# Altium schematic sheet dieukhien.SchDoc
size A0
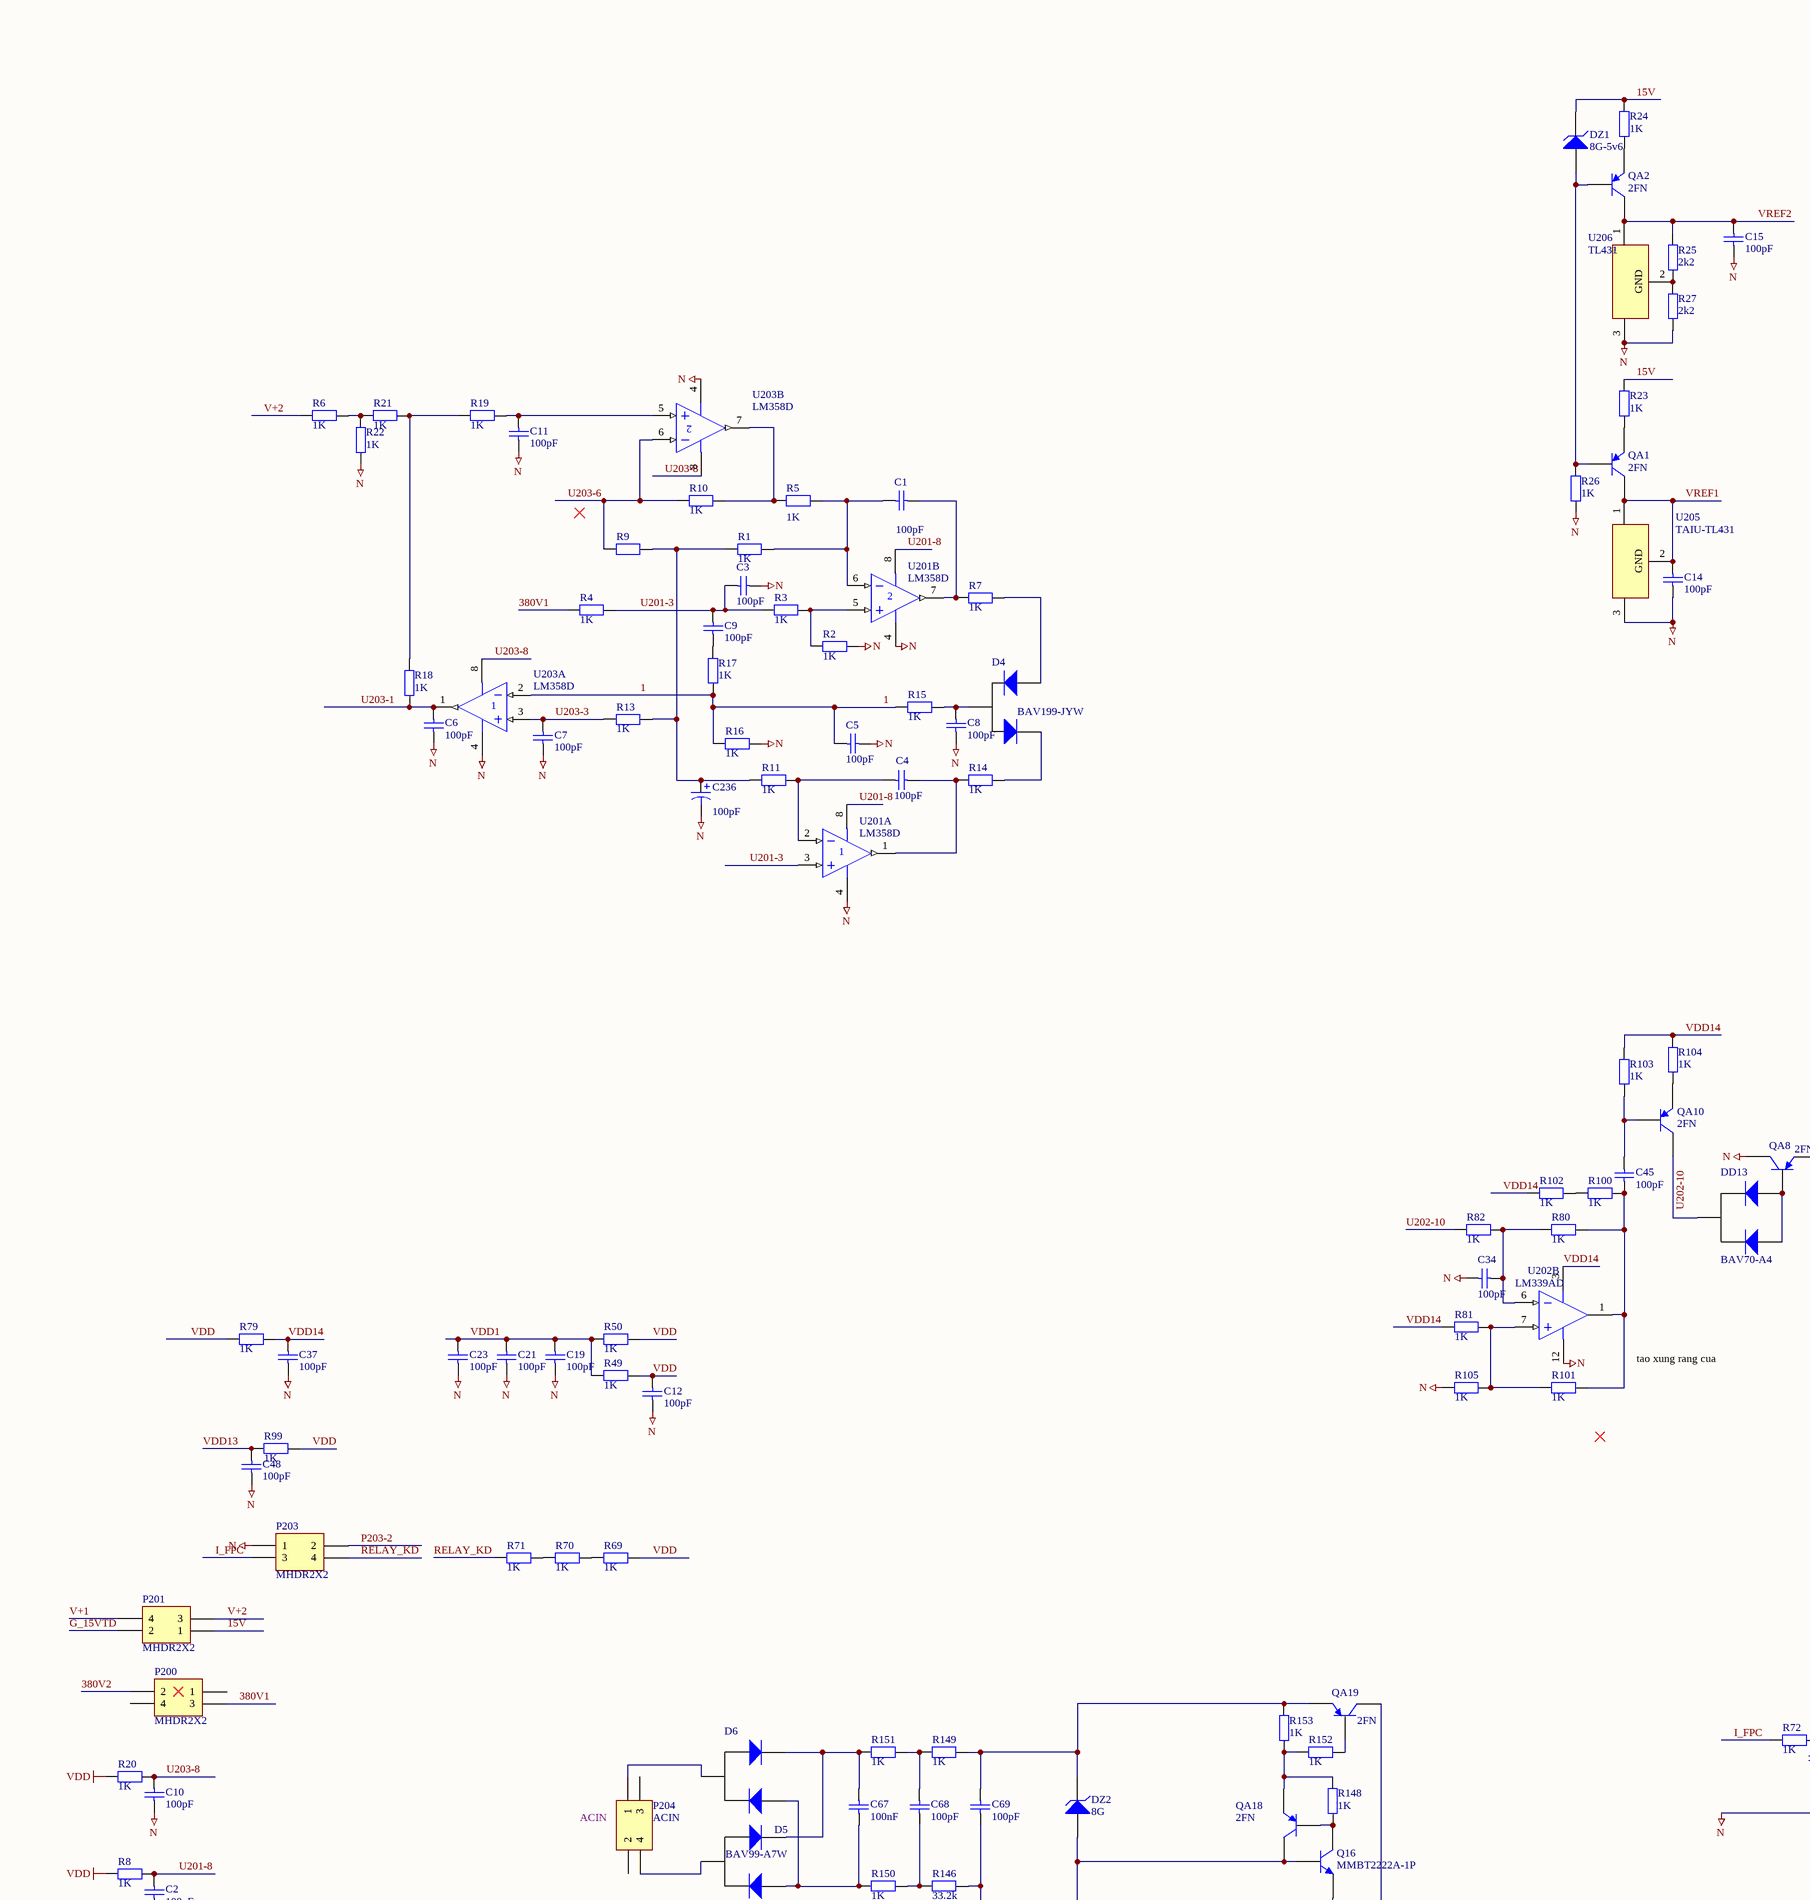
[diagram p0: dieukhien.SchDoc, top left]
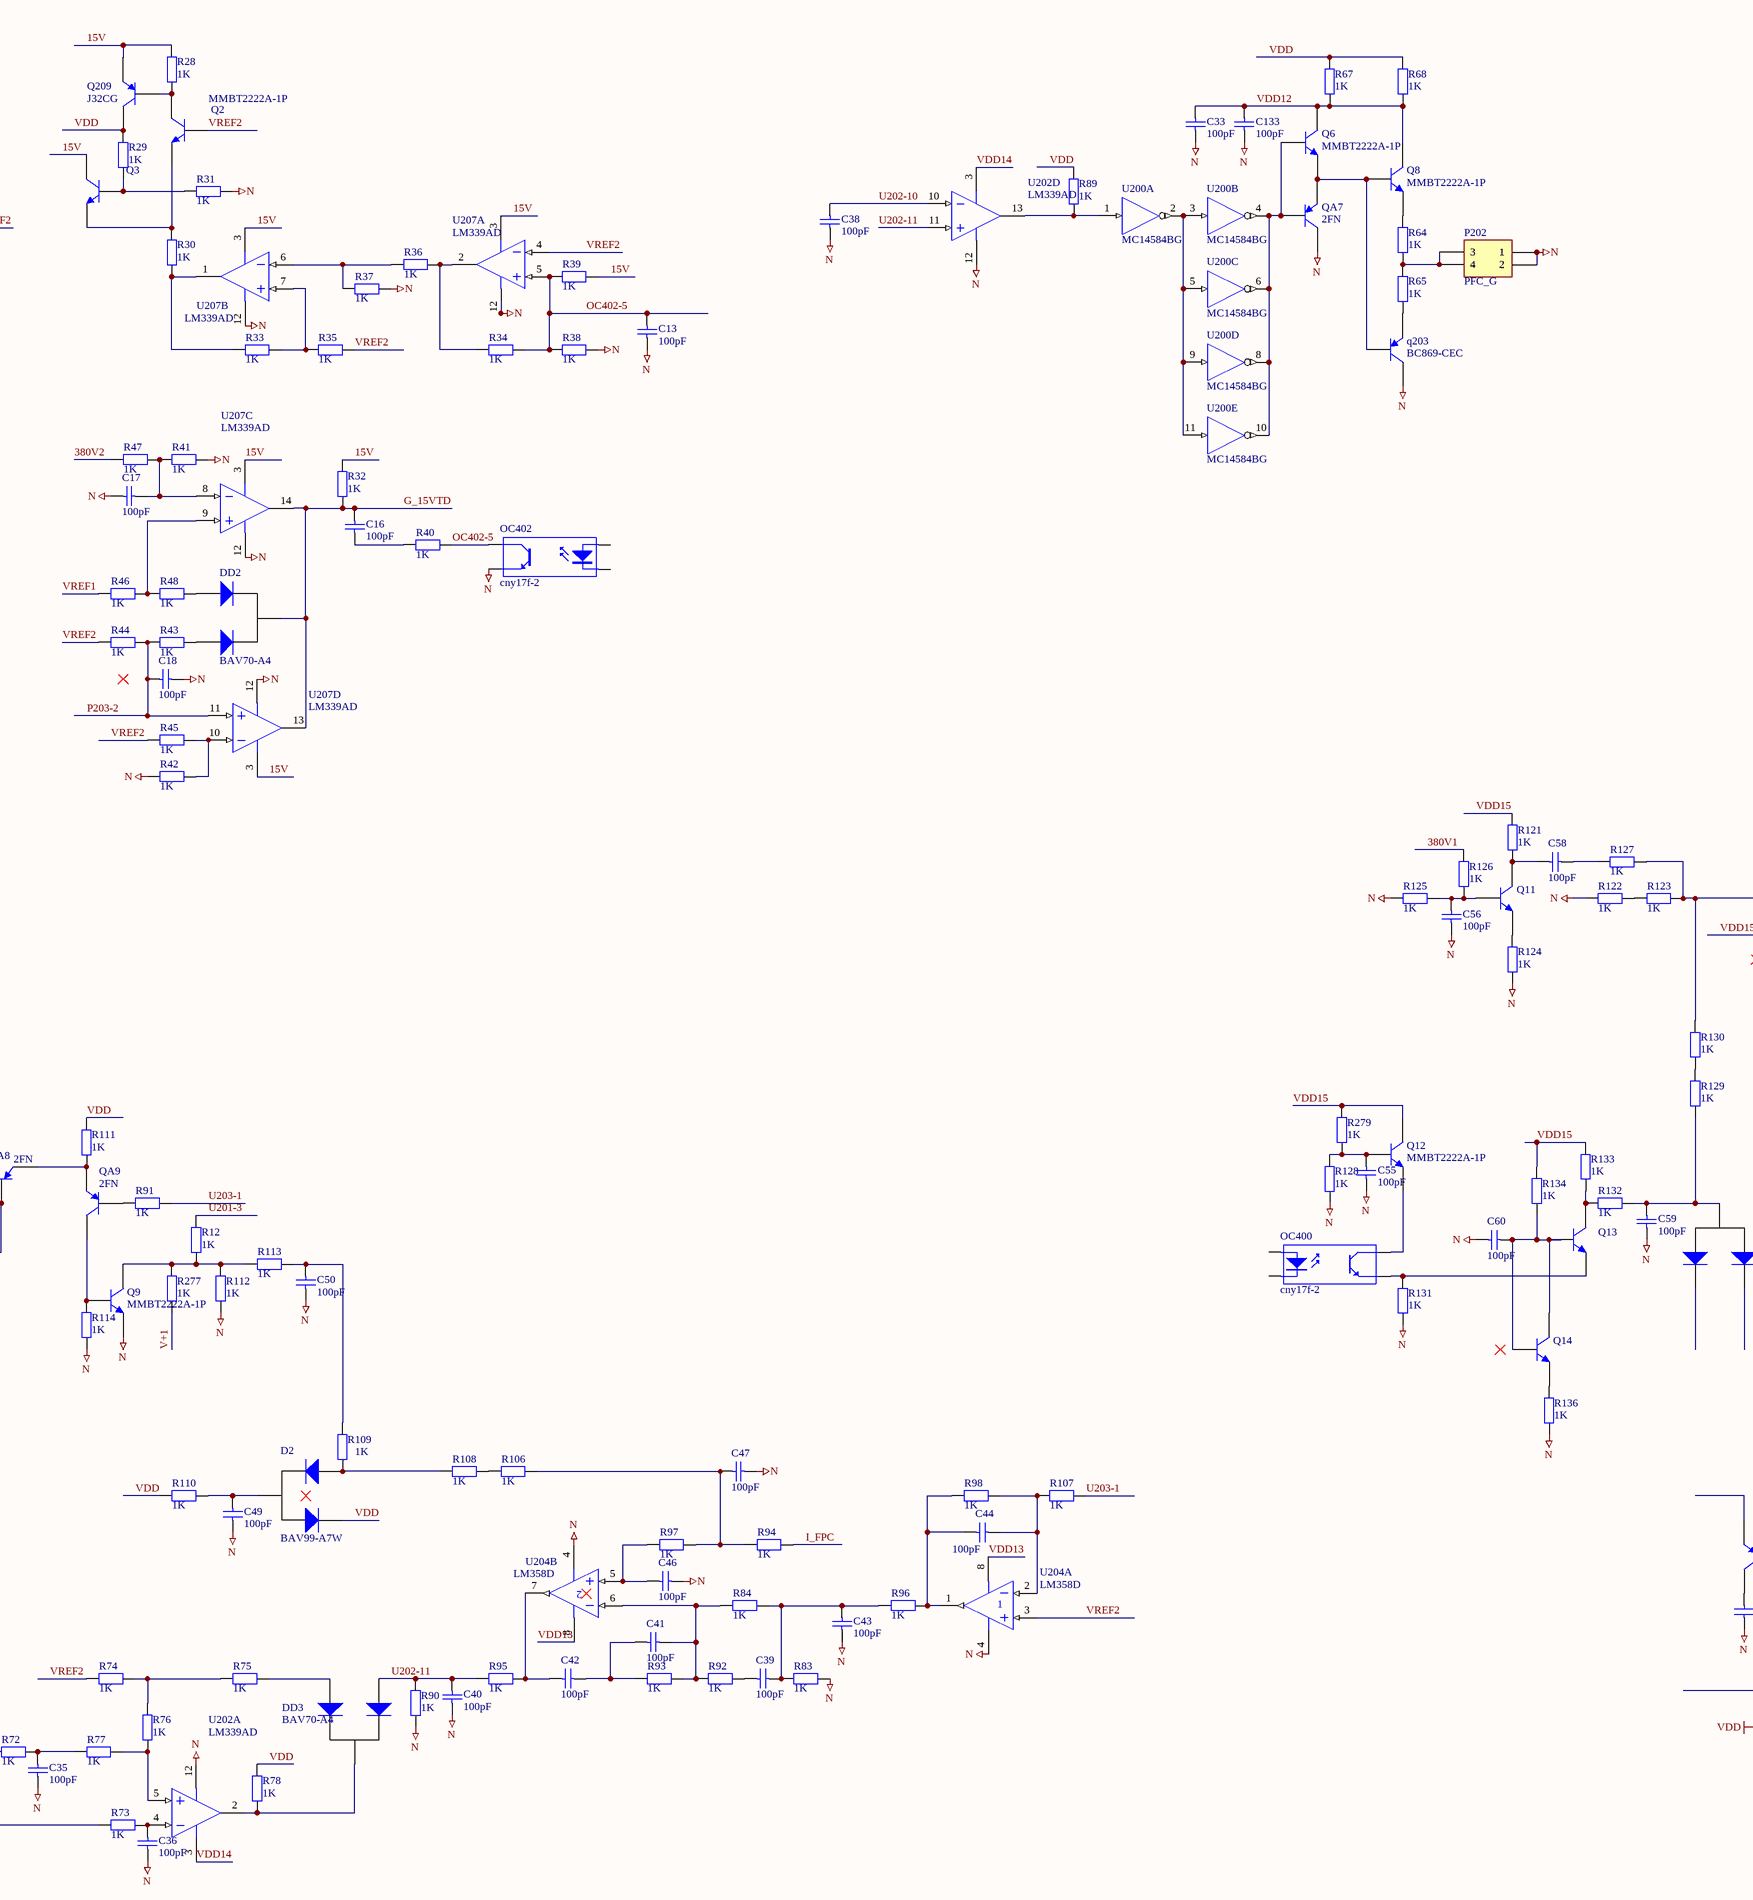
[diagram p1: dieukhien.SchDoc, top middle]
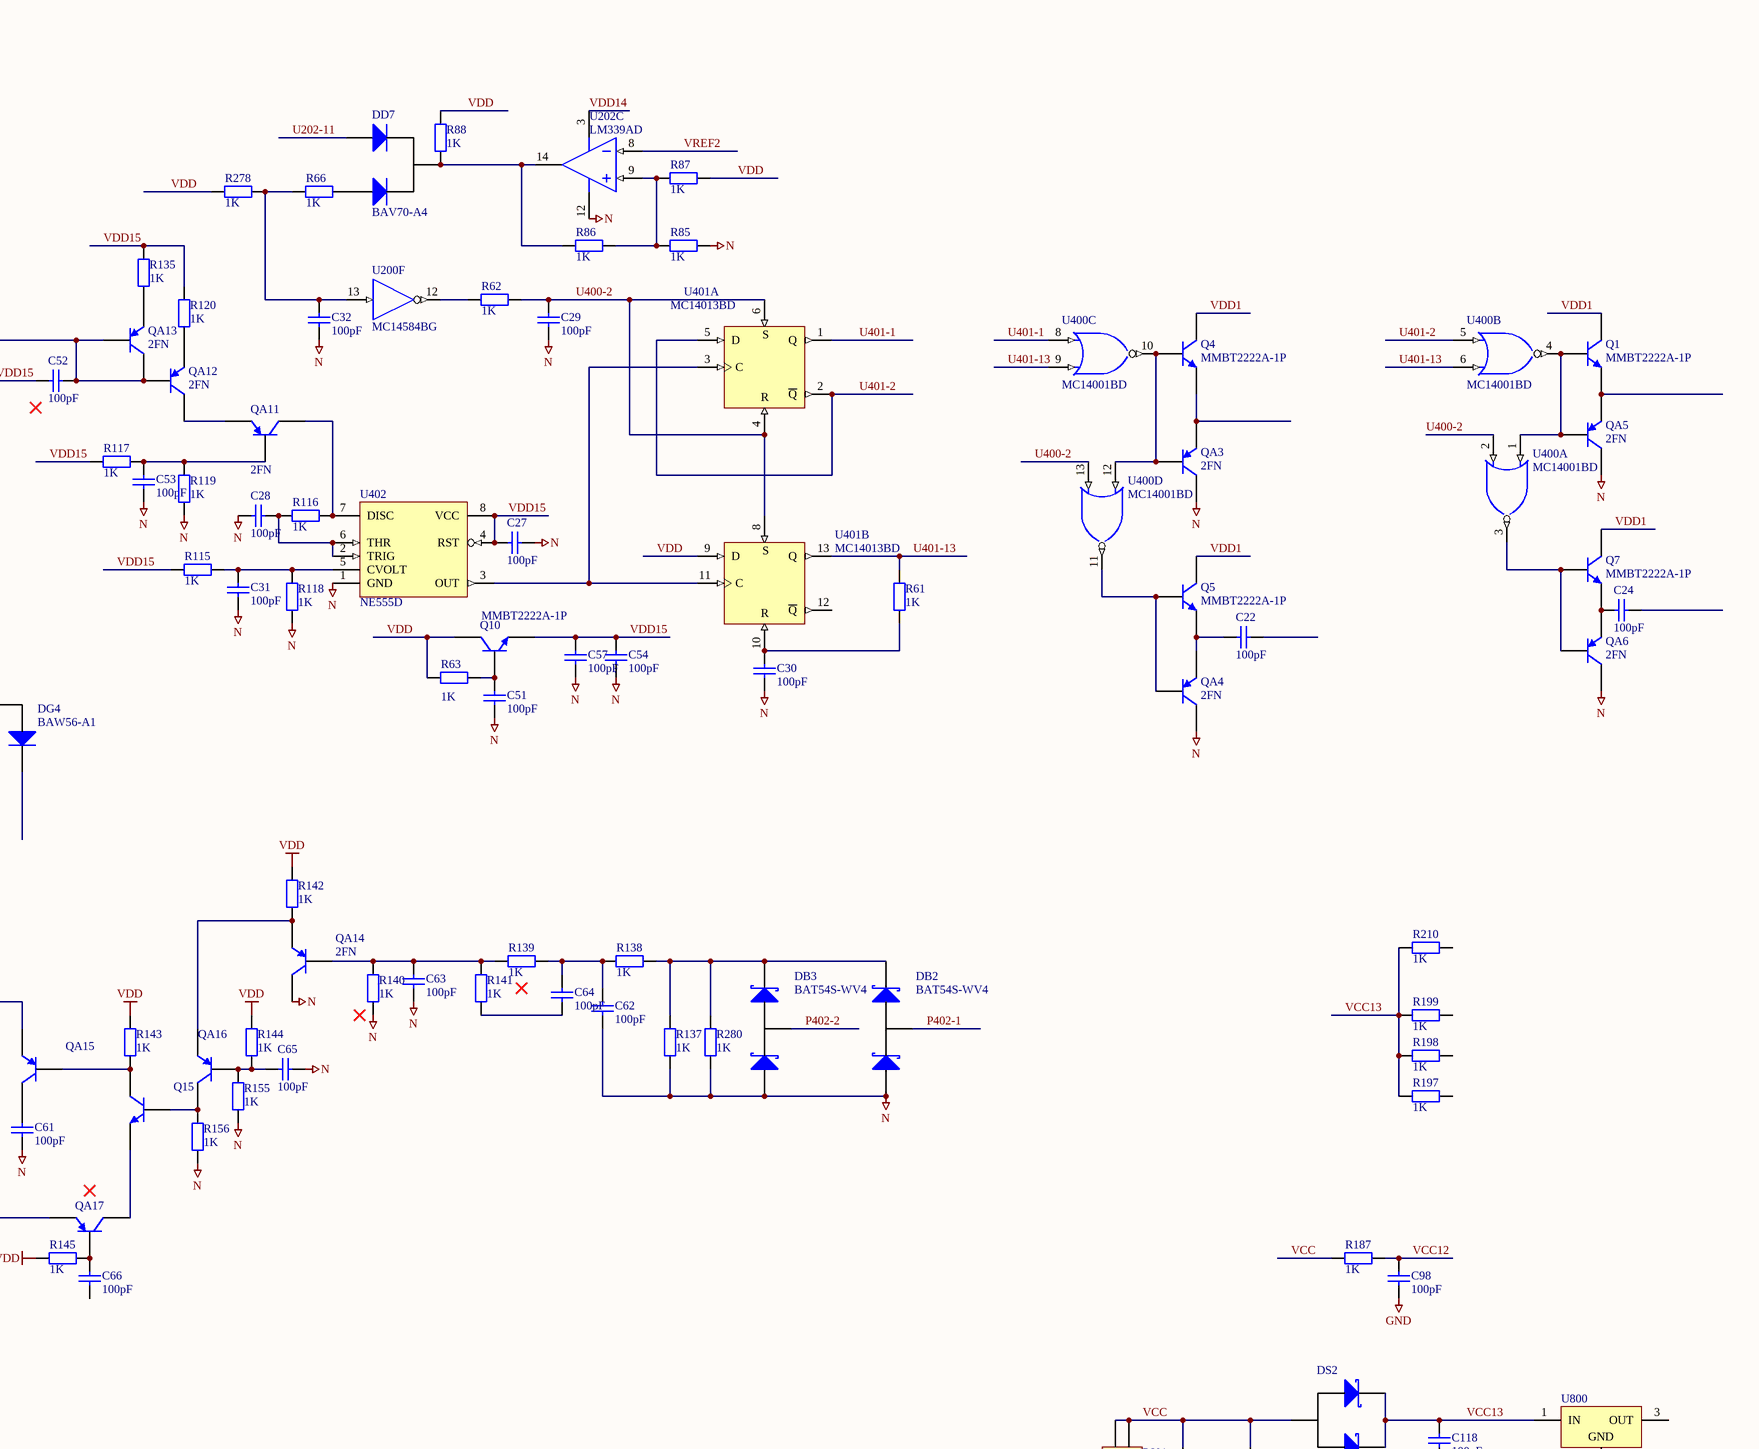
[diagram p2: dieukhien.SchDoc, top right]
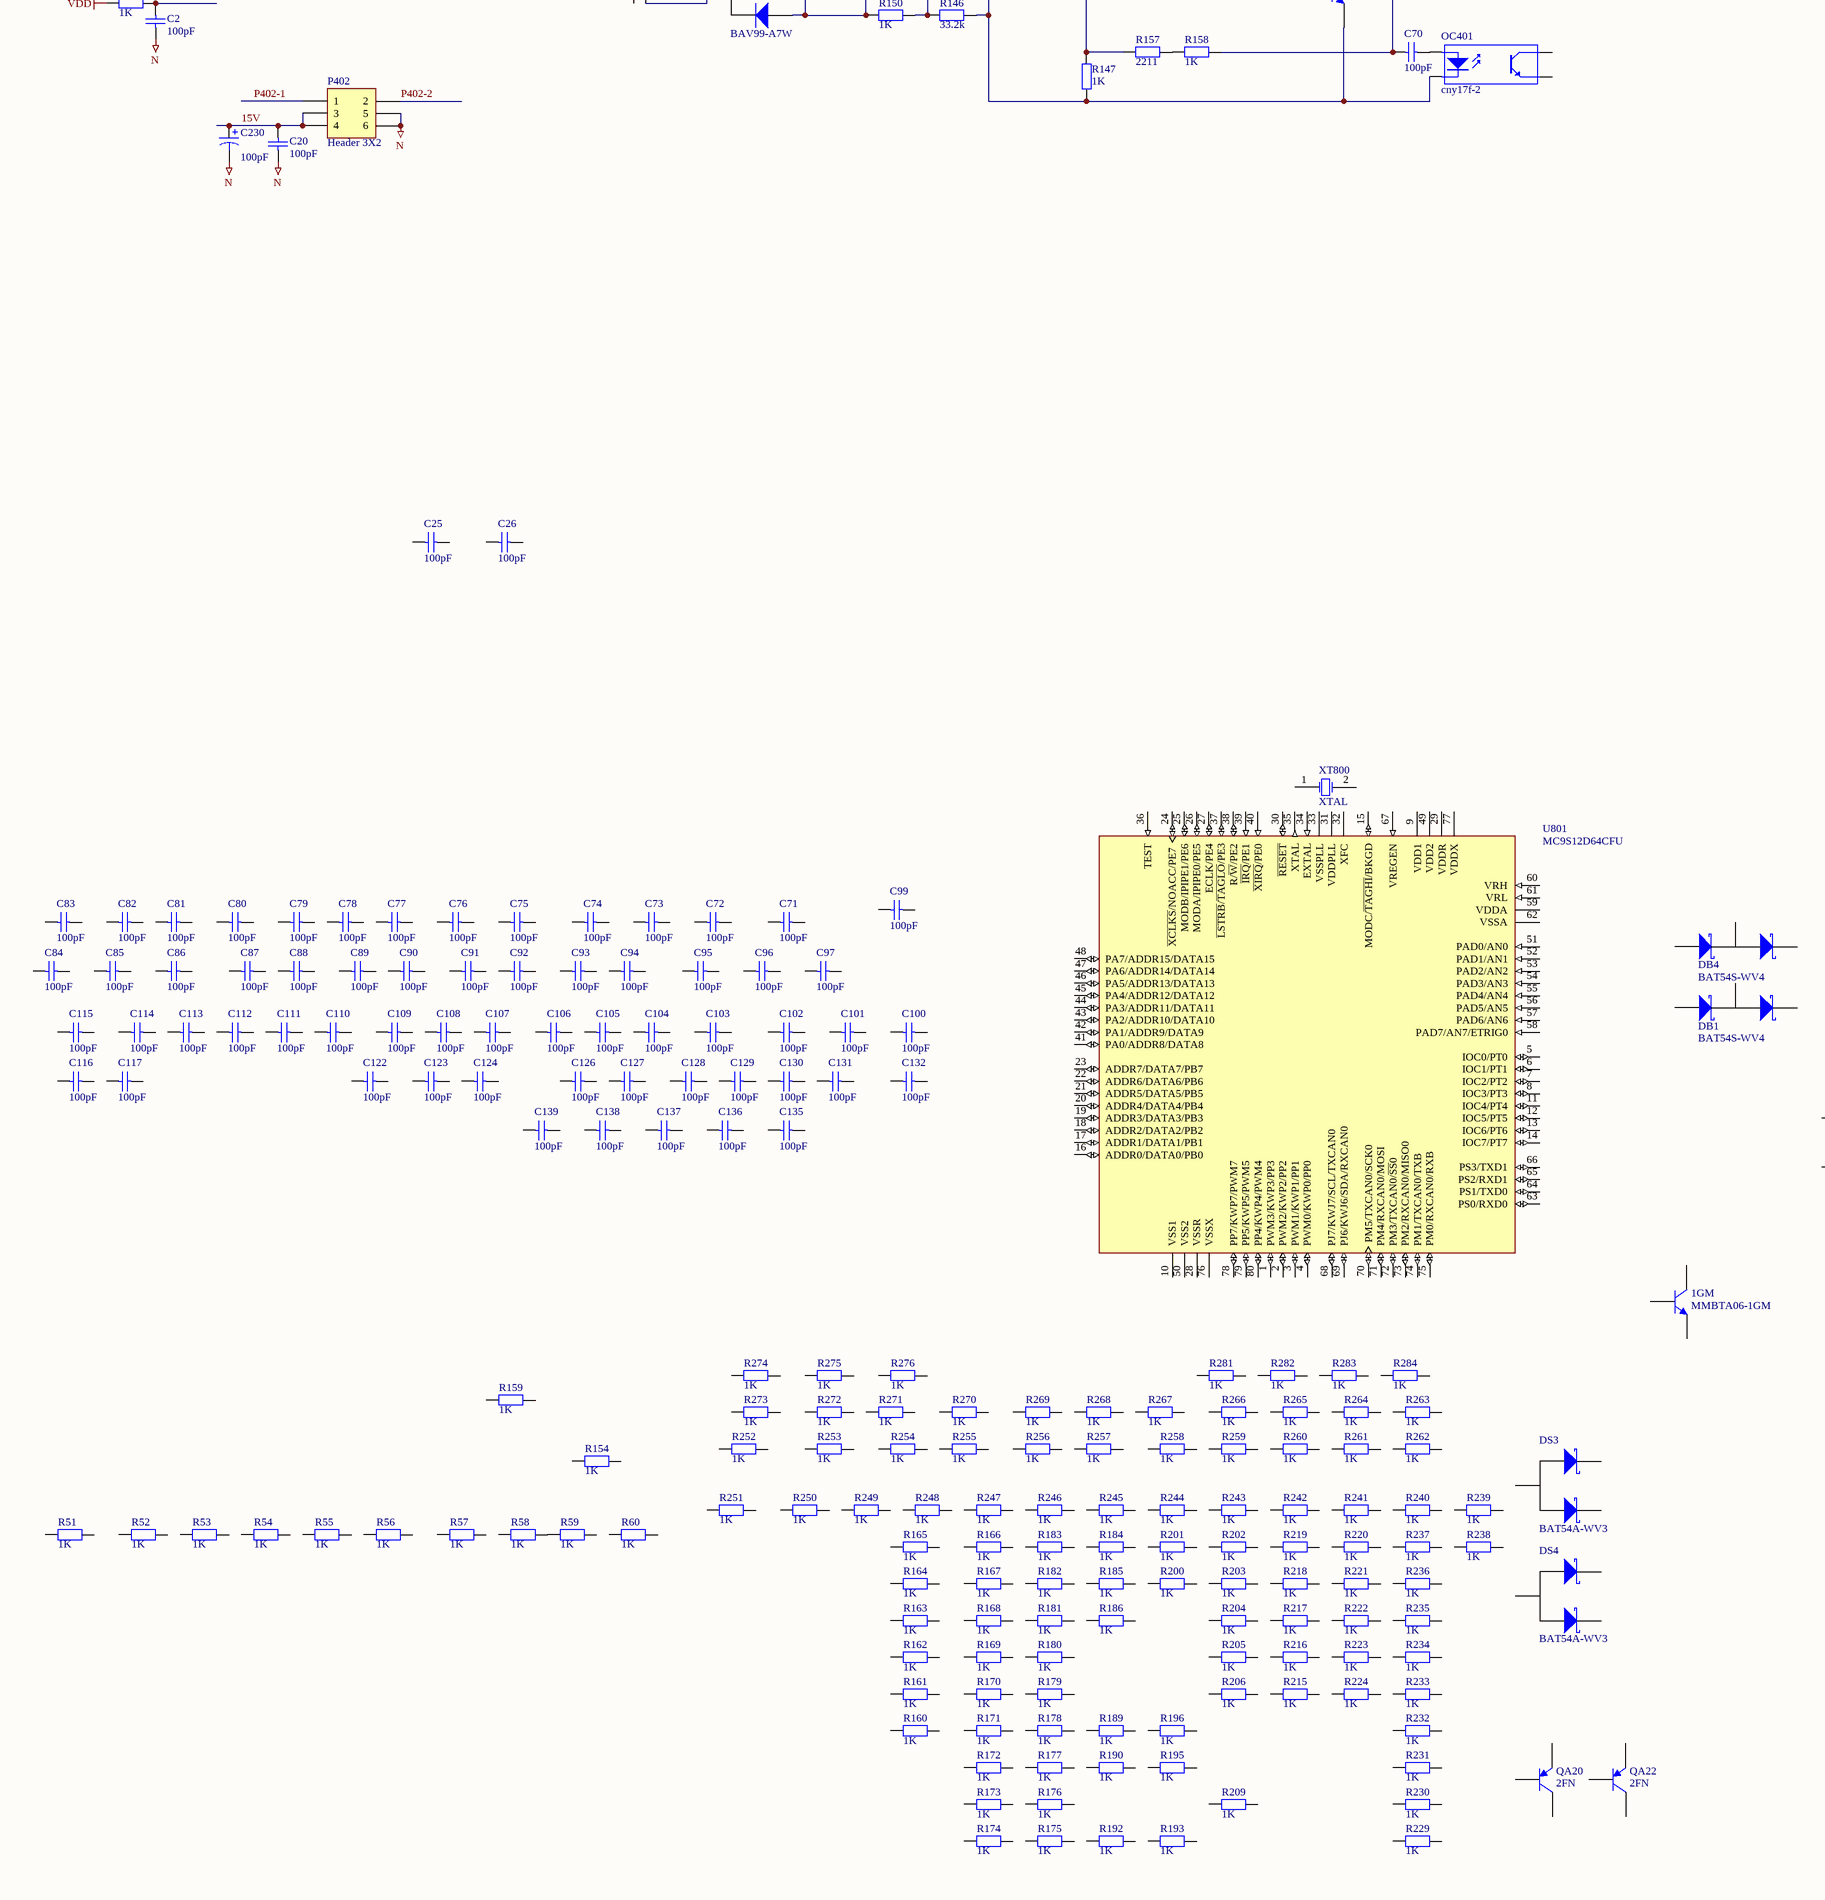
[diagram p3: dieukhien.SchDoc, bottom left]
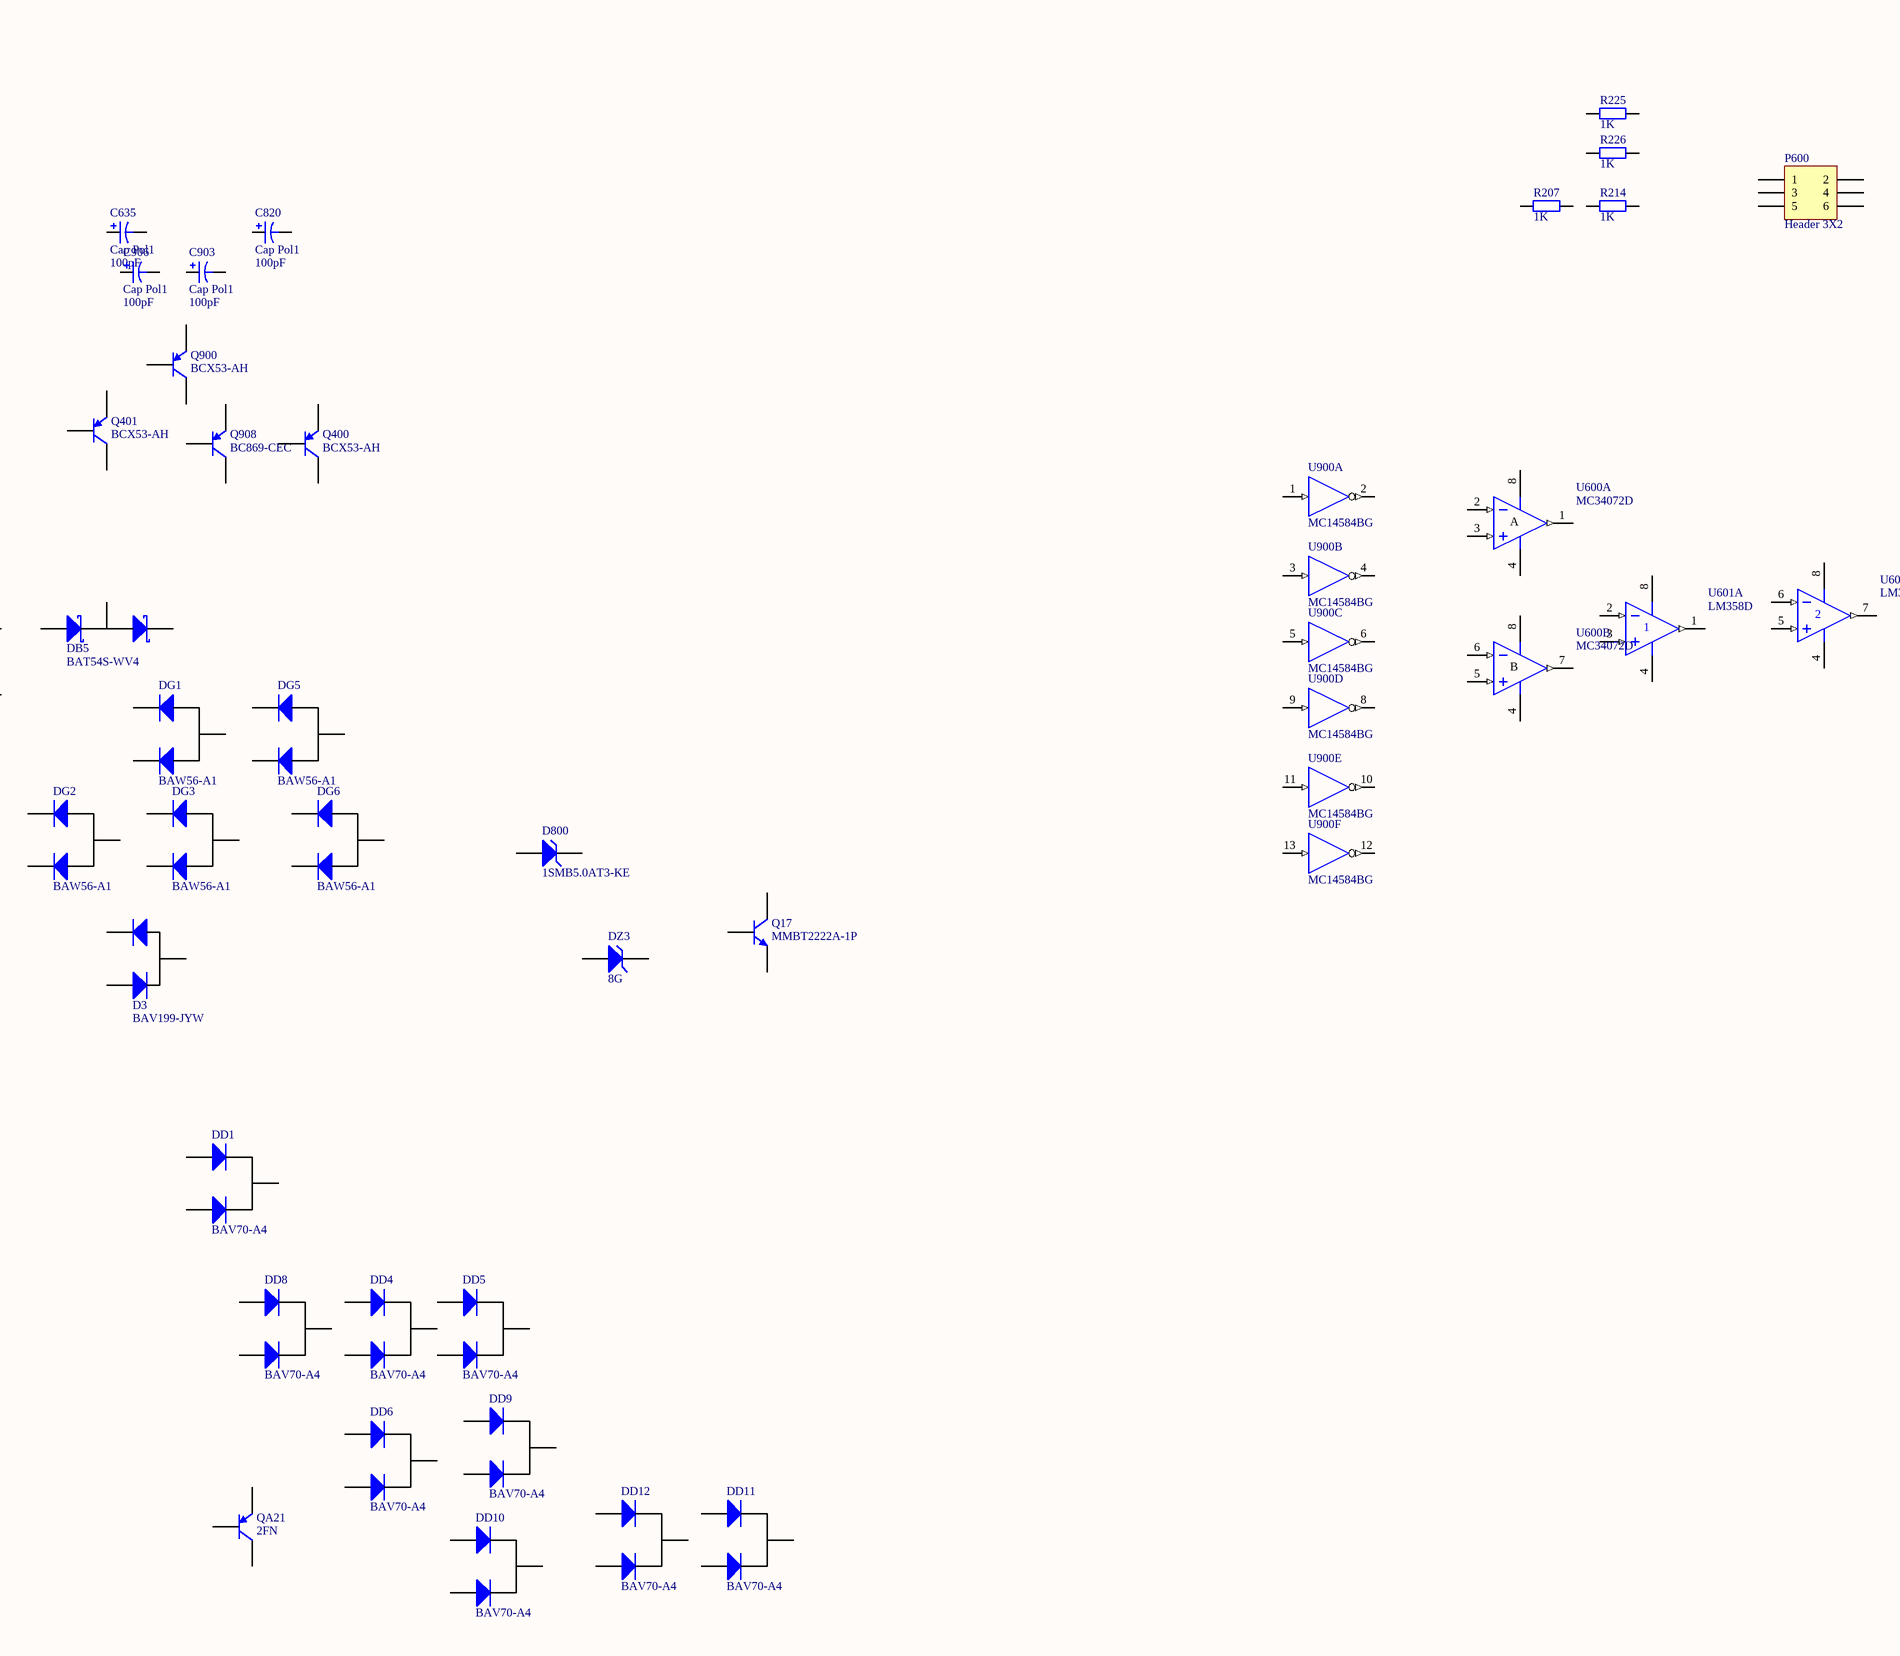
[diagram p4: dieukhien.SchDoc, bottom middle]
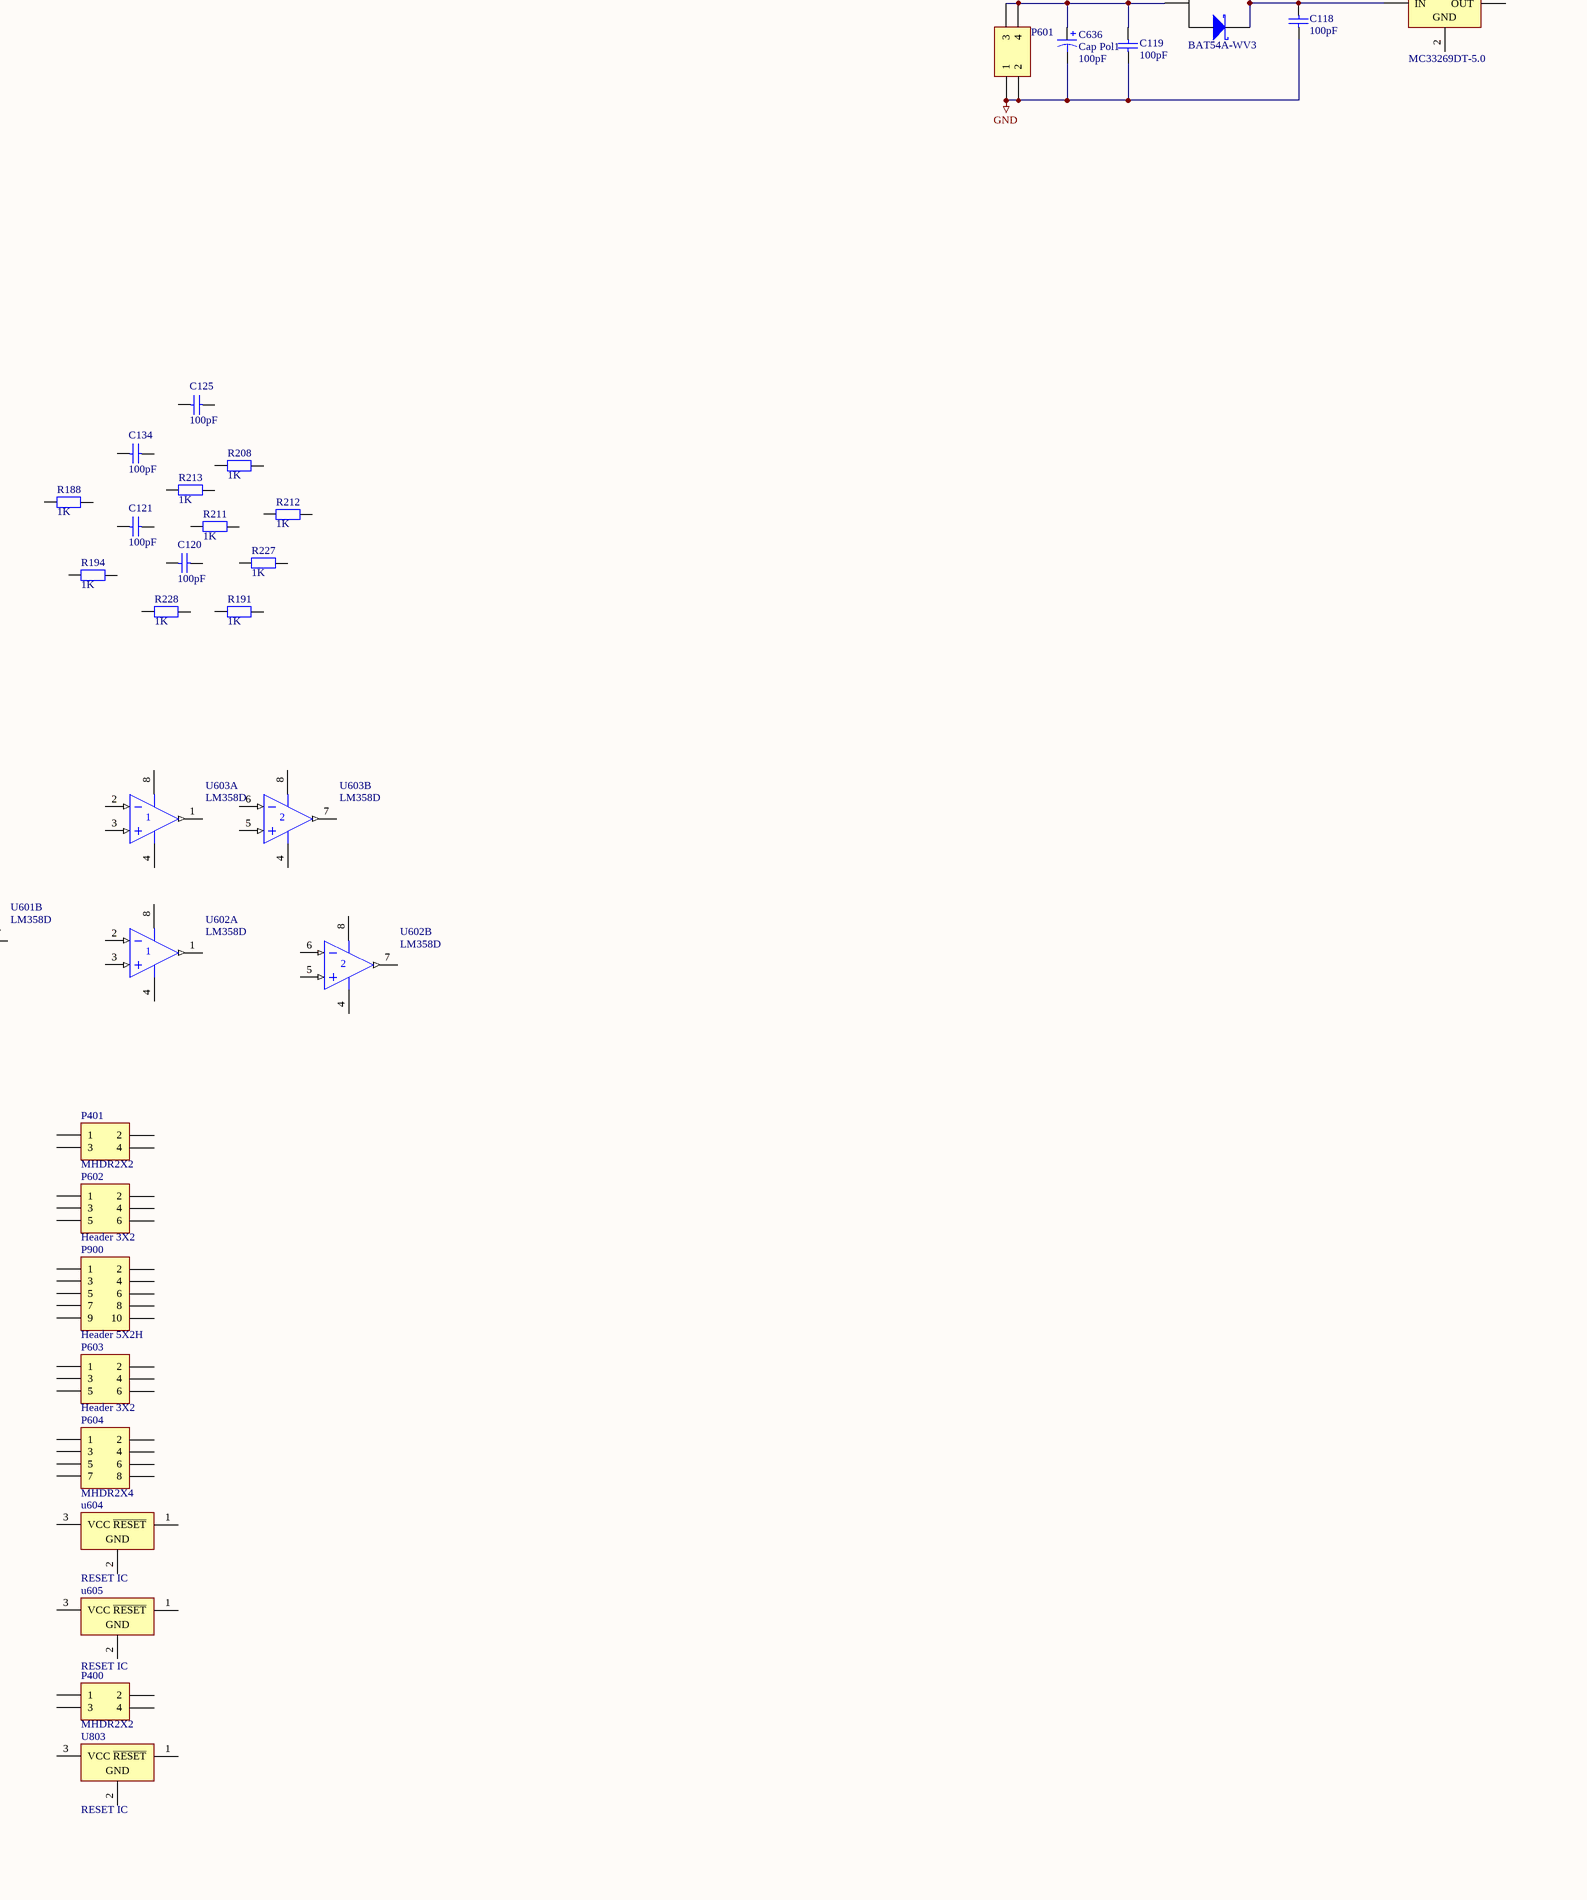
[diagram p5: dieukhien.SchDoc, bottom right]

## Parts
1GM  MMBTA06-1GM  [SOT23A]
C1  value 100pF  [C0805]  (hidden comment: Cap)
C2  value 100pF  [C0805]  (hidden comment: Cap)
C3  value 100pF  [C0805]  (hidden comment: Cap)
C4  value 100pF  [C0805]  (hidden comment: Cap)
C5  value 100pF  [C0805]  (hidden comment: Cap)
C6  value 100pF  [C0805]  (hidden comment: Cap)
C7  value 100pF  [C0805]  (hidden comment: Cap)
C8  value 100pF  [C0805]  (hidden comment: Cap)
C9  value 100pF  [C0805]  (hidden comment: Cap)
C10  value 100pF  [C0805]  (hidden comment: Cap)
C11  value 100pF  [C0805]  (hidden comment: Cap)
C12  value 100pF  [C0805]  (hidden comment: Cap)
C13  value 100pF  [C0805]  (hidden comment: Cap)
C14  value 100pF  [C0805]  (hidden comment: Cap)
C15  value 100pF  [C0805]  (hidden comment: Cap)
C16  value 100pF  [C0805]  (hidden comment: Cap)
C17  value 100pF  [C0805]  (hidden comment: Cap)
C18  value 100pF  [C0805]  (hidden comment: Cap)
C19  value 100pF  [C0805]  (hidden comment: Cap)
C20  value 100pF  [C0805]  (hidden comment: Cap)
C21  value 100pF  [C0805]  (hidden comment: Cap)
C22  value 100pF  [C0805]  (hidden comment: Cap)
C23  value 100pF  [C0805]  (hidden comment: Cap)
C24  value 100pF  [C0805]  (hidden comment: Cap)
C25  value 100pF  [C0805]  (hidden comment: Cap)
C26  value 100pF  [C0805]  (hidden comment: Cap)
C27  value 100pF  [C0805]  (hidden comment: Cap)
C28  value 100pF  [C0805]  (hidden comment: Cap)
C29  value 100pF  [C0805]  (hidden comment: Cap)
C30  value 100pF  [C0805]  (hidden comment: Cap)
C31  value 100pF  [C0805]  (hidden comment: Cap)
C32  value 100pF  [C0805]  (hidden comment: Cap)
C33  value 100pF  [C0805]  (hidden comment: Cap)
C34  value 100pF  [C0805]  (hidden comment: Cap)
C35  value 100pF  [C0805]  (hidden comment: Cap)
C36  value 100pF  [C0805]  (hidden comment: Cap)
C37  value 100pF  [C0805]  (hidden comment: Cap)
C38  value 100pF  [C0805]  (hidden comment: Cap)
C39  value 100pF  [C0805]  (hidden comment: Cap)
C40  value 100pF  [C0805]  (hidden comment: Cap)
C41  value 100pF  [C0805]  (hidden comment: Cap)
C42  value 100pF  [C0805]  (hidden comment: Cap)
C43  value 100pF  [C0805]  (hidden comment: Cap)
C44  value 100pF  [C0805]  (hidden comment: Cap)
C45  value 100pF  [C0805]  (hidden comment: Cap)
C46  value 100pF  [C0805]  (hidden comment: Cap)
C47  value 100pF  [C0805]  (hidden comment: Cap)
C48  value 100pF  [C0805]  (hidden comment: Cap)
C49  value 100pF  [C0805]  (hidden comment: Cap)
C50  value 100pF  [C0805]  (hidden comment: Cap)
C51  value 100pF  [C0805]  (hidden comment: Cap)
C52  value 100pF  [C0805]  (hidden comment: Cap)
C53  value 100pF  [C0805]  (hidden comment: Cap)
C54  value 100pF  [C0805]  (hidden comment: Cap)
C55  value 100pF  [C0805]  (hidden comment: Cap)
C56  value 100pF  [C0805]  (hidden comment: Cap)
C57  value 100pF  [C0805]  (hidden comment: Cap)
C58  value 100pF  [C0805]  (hidden comment: Cap)
C59  value 100pF  [C0805]  (hidden comment: Cap)
C60  value 100pF  [C0805]  (hidden comment: Cap)
C61  value 100pF  [C0805]  (hidden comment: Cap)
C62  value 100pF  [C0805]  (hidden comment: Cap)
C63  value 100pF  [C0805]  (hidden comment: Cap)
C64  value 100pF  [C0805]  (hidden comment: Cap)
C65  value 100pF  [C0805]  (hidden comment: Cap)
C66  value 100pF  [C0805]  (hidden comment: Cap)
C67  value 100nF  [C0805]  (hidden comment: Cap)
C68  value 100pF  [C0805]  (hidden comment: Cap)
C69  value 100pF  [C0805]  (hidden comment: Cap)
C70  value 100pF  [C0805]  (hidden comment: Cap)
C71  value 100pF  [C0805]  (hidden comment: Cap)
C72  value 100pF  [C0805]  (hidden comment: Cap)
C73  value 100pF  [C0805]  (hidden comment: Cap)
C74  value 100pF  [C0805]  (hidden comment: Cap)
C75  value 100pF  [C0805]  (hidden comment: Cap)
C76  value 100pF  [C0805]  (hidden comment: Cap)
C77  value 100pF  [C0805]  (hidden comment: Cap)
C78  value 100pF  [C0805]  (hidden comment: Cap)
C79  value 100pF  [C0805]  (hidden comment: Cap)
C80  value 100pF  [C0805]  (hidden comment: Cap)
C81  value 100pF  [C0805]  (hidden comment: Cap)
C82  value 100pF  [C0805]  (hidden comment: Cap)
C83  value 100pF  [C0805]  (hidden comment: Cap)
C84  value 100pF  [C0805]  (hidden comment: Cap)
C85  value 100pF  [C0805]  (hidden comment: Cap)
C86  value 100pF  [C0805]  (hidden comment: Cap)
C87  value 100pF  [C0805]  (hidden comment: Cap)
C88  value 100pF  [C0805]  (hidden comment: Cap)
C89  value 100pF  [C0805]  (hidden comment: Cap)
C90  value 100pF  [C0805]  (hidden comment: Cap)
C91  value 100pF  [C0805]  (hidden comment: Cap)
C92  value 100pF  [C0805]  (hidden comment: Cap)
C93  value 100pF  [C0805]  (hidden comment: Cap)
C94  value 100pF  [C0805]  (hidden comment: Cap)
C95  value 100pF  [C0805]  (hidden comment: Cap)
C96  value 100pF  [C0805]  (hidden comment: Cap)
C97  value 100pF  [C0805]  (hidden comment: Cap)
C98  value 100pF  [C0805]  (hidden comment: Cap)
C99  value 100pF  [C0805]  (hidden comment: Cap)
C100  value 100pF  [C0805]  (hidden comment: Cap)
C101  value 100pF  [C0805]  (hidden comment: Cap)
C102  value 100pF  [C0805]  (hidden comment: Cap)
C103  value 100pF  [C0805]  (hidden comment: Cap)
C104  value 100pF  [C0805]  (hidden comment: Cap)
C105  value 100pF  [C0805]  (hidden comment: Cap)
C106  value 100pF  [C0805]  (hidden comment: Cap)
C107  value 100pF  [C0805]  (hidden comment: Cap)
C108  value 100pF  [C0805]  (hidden comment: Cap)
C109  value 100pF  [C0805]  (hidden comment: Cap)
C110  value 100pF  [C0805]  (hidden comment: Cap)
C111  value 100pF  [C0805]  (hidden comment: Cap)
C112  value 100pF  [C0805]  (hidden comment: Cap)
C113  value 100pF  [C0805]  (hidden comment: Cap)
C114  value 100pF  [C0805]  (hidden comment: Cap)
C115  value 100pF  [C0805]  (hidden comment: Cap)
C116  value 100pF  [C0805]  (hidden comment: Cap)
C117  value 100pF  [C0805]  (hidden comment: Cap)
C118  value 100pF  [C0805]  (hidden comment: Cap)
C119  value 100pF  [C0805]  (hidden comment: Cap)
C120  value 100pF  [C0805]  (hidden comment: Cap)
C121  value 100pF  [C0805]  (hidden comment: Cap)
C122  value 100pF  [C0805]  (hidden comment: Cap)
C123  value 100pF  [C0805]  (hidden comment: Cap)
C124  value 100pF  [C0805]  (hidden comment: Cap)
C125  value 100pF  [C0805]  (hidden comment: Cap)
C126  value 100pF  [C0805]  (hidden comment: Cap)
C127  value 100pF  [C0805]  (hidden comment: Cap)
C128  value 100pF  [C0805]  (hidden comment: Cap)
C129  value 100pF  [C0805]  (hidden comment: Cap)
C130  value 100pF  [C0805]  (hidden comment: Cap)
C131  value 100pF  [C0805]  (hidden comment: Cap)
C132  value 100pF  [C0805]  (hidden comment: Cap)
C133  value 100pF  [C0805]  (hidden comment: Cap)
C134  value 100pF  [C0805]  (hidden comment: Cap)
C135  value 100pF  [C0805]  (hidden comment: Cap)
C136  value 100pF  [C0805]  (hidden comment: Cap)
C137  value 100pF  [C0805]  (hidden comment: Cap)
C138  value 100pF  [C0805]  (hidden comment: Cap)
C139  value 100pF  [C0805]  (hidden comment: Cap)
C230  value 100pF  [A]  (hidden comment: Cap Pol1)
C236  value 100pF  [A]  (hidden comment: Cap Pol1)
C635  Cap Pol1  value 100pF  [A]
C636  Cap Pol1  value 100pF  [A]
C820  Cap Pol1  value 100pF  [A]
C903  Cap Pol1  value 100pF  [CAPPR5-5x5]
C906  Cap Pol1  value 100pF  [CAPPR5-5x5]
D2  BAV99-A7W  [SOT-23B]
D3  BAV199-JYW  [SOT23A]
D4  BAV199-JYW  [SOT23A]
D5  BAV99-A7W  [SOT-23B]
D6  BAV99-A7W  [SOT-23B]
D800  1SMB5.0AT3-KE  [SMB]
DB1  BAT54S-WV4  [SOT23A]
DB2  BAT54S-WV4  [SOT23A]
DB3  BAT54S-WV4  [SOT23A]
DB4  BAT54S-WV4  [SOT23A]
DB5  BAT54S-WV4  [SOT23A]
DD1  BAV70-A4  [SOT23A]
DD2  BAV70-A4  [SOT23A]
DD3  BAV70-A4  [SOT23A]
DD4  BAV70-A4  [SOT23A]
DD5  BAV70-A4  [SOT23A]
DD6  BAV70-A4  [SOT23A]
DD7  BAV70-A4  [SOT23A]
DD8  BAV70-A4  [SOT23A]
DD9  BAV70-A4  [SOT23A]
DD10  BAV70-A4  [SOT23A]
DD11  BAV70-A4  [SOT23A]
DD12  BAV70-A4  [SOT23A]
DD13  BAV70-A4  [SOT23A]
DG1  BAW56-A1  [SOT23A]
DG2  BAW56-A1  [SOT23A]
DG3  BAW56-A1  [SOT23A]
DG4  BAW56-A1  [SOT23A]
DG5  BAW56-A1  [SOT23A]
DG6  BAW56-A1  [SOT23A]
DS2  BAT54A-WV3  [SOT23A]
DS3  BAT54A-WV3  [SOT23A]
DS4  BAT54A-WV3  [SOT23A]
DZ1  8G-5v6  [SOT-23B]
DZ2  8G  [SOT-23B]
DZ3  8G  [SOT-23B]
OC400  cny17f-2  [SMD-6]
OC401  cny17f-2  [SMD-6]
OC402  cny17f-2  [SMD-6]
P200  MHDR2X2  [MHDR2X2]
P201  MHDR2X2  [MHDR2X2]
P202  PFC_G  [MHDR2X2]
P203  MHDR2X2  [MHDR2X2]
P204  ACIN  [MHDR2X2]
P400  MHDR2X2  [MHDR2X2]
P401  MHDR2X2  [MHDR2X2]
P402  Header 3X2  [MHDR2X3]
P600  Header 3X2  [MHDR2X3]
P601  MHDR2X2  [MHDR2X2]  (value not drawn)
P602  Header 3X2  [MHDR2X3]
P603  Header 3X2  [MHDR2X3]
P604  MHDR2X4  [MHDR2X4]
P900  Header 5X2H  [HDR2X5H]
Q1  MMBT2222A-1P  [SOT23A]
Q2  MMBT2222A-1P  [SOT23A]
Q3  MMBT2222A-1P  [SOT23A]  (value not drawn)
Q4  MMBT2222A-1P  [SOT23A]
Q5  MMBT2222A-1P  [SOT23A]
Q6  MMBT2222A-1P  [SOT23A]
Q7  MMBT2222A-1P  [SOT23A]
Q8  MMBT2222A-1P  [SOT23A]
Q9  MMBT2222A-1P  [SOT23A]
Q10  MMBT2222A-1P  [SOT23A]
Q11  MMBT2222A-1P  [SOT23A]  (value not drawn)
Q12  MMBT2222A-1P  [SOT23A]
Q13  MMBT2222A-1P  [SOT23A]  (value not drawn)
Q14  MMBT2222A-1P  [SOT23A]  (value not drawn)
Q15  MMBT2222A-1P  [SOT23A]  (value not drawn)
Q16  MMBT2222A-1P  [SOT23A]
Q17  MMBT2222A-1P  [SOT23A]
q203  BC869-CEC  [SOT89]
Q209  J32CG  [TO228P960-3_4L]
Q400  BCX53-AH  [SOT89]
Q401  BCX53-AH  [SOT89]
Q900  BCX53-AH  [SOT89]
Q908  BC869-CEC  [SOT89]
QA1  2FN  [SOT-23B]
QA2  2FN  [SOT-23B]
QA3  2FN  [SOT-23B]
QA4  2FN  [SOT-23B]
QA5  2FN  [SOT-23B]
QA6  2FN  [SOT-23B]
QA7  2FN  [SOT-23B]
QA8  2FN  [SOT-23B]
QA9  2FN  [SOT-23B]
QA10  2FN  [SOT-23B]
QA11  2FN  [SOT-23B]
QA12  2FN  [SOT-23B]
QA13  2FN  [SOT-23B]
QA14  2FN  [SOT-23B]
QA15  2FN  [SOT-23B]  (value not drawn)
QA16  2FN  [SOT-23B]  (value not drawn)
QA17  2FN  [SOT-23B]  (value not drawn)
QA18  2FN  [SOT-23B]
QA19  2FN  [SOT-23B]
QA20  2FN  [SOT-23B]
QA21  2FN  [SOT-23B]
QA22  2FN  [SOT-23B]
R1  value 1K  [2012[0805]]  (hidden comment: Res2)
R2  value 1K  [2012[0805]]  (hidden comment: Res2)
R3  value 1K  [2012[0805]]  (hidden comment: Res2)
R4  value 1K  [2012[0805]]  (hidden comment: Res2)
R5  value 1K  [2012[0805]]  (hidden comment: Res2)
R6  value 1K  [2012[0805]]  (hidden comment: Res2)
R7  value 1K  [2012[0805]]  (hidden comment: Res2)
R8  value 1K  [2012[0805]]  (hidden comment: Res2)
R9  Res2  [2012[0805]]  (value not drawn)
R10  value 1K  [2012[0805]]  (hidden comment: Res2)
R11  value 1K  [2012[0805]]  (hidden comment: Res2)
R12  value 1K  [2012[0805]]  (hidden comment: Res2)
R13  value 1K  [2012[0805]]  (hidden comment: Res2)
R14  value 1K  [2012[0805]]  (hidden comment: Res2)
R15  value 1K  [2012[0805]]  (hidden comment: Res2)
R16  value 1K  [2012[0805]]  (hidden comment: Res2)
R17  value 1K  [2012[0805]]  (hidden comment: Res2)
R18  value 1K  [2012[0805]]  (hidden comment: Res2)
R19  value 1K  [2012[0805]]  (hidden comment: Res2)
R20  value 1K  [2012[0805]]  (hidden comment: Res2)
R21  value 1K  [2012[0805]]  (hidden comment: Res2)
R22  value 1K  [2012[0805]]  (hidden comment: Res2)
R23  value 1K  [2012[0805]]  (hidden comment: Res2)
R24  value 1K  [2012[0805]]  (hidden comment: Res2)
R25  value 2k2  [2012[0805]]  (hidden comment: Res2)
R26  value 1K  [2012[0805]]  (hidden comment: Res2)
R27  value 2k2  [2012[0805]]  (hidden comment: Res2)
R28  value 1K  [2012[0805]]  (hidden comment: Res2)
R29  value 1K  [2012[0805]]  (hidden comment: Res2)
R30  value 1K  [2012[0805]]  (hidden comment: Res2)
R31  value 1K  [2012[0805]]  (hidden comment: Res2)
R32  value 1K  [2012[0805]]  (hidden comment: Res2)
R33  value 1K  [2012[0805]]  (hidden comment: Res2)
R34  value 1K  [2012[0805]]  (hidden comment: Res2)
R35  value 1K  [2012[0805]]  (hidden comment: Res2)
R36  value 1K  [2012[0805]]  (hidden comment: Res2)
R37  value 1K  [2012[0805]]  (hidden comment: Res2)
R38  value 1K  [2012[0805]]  (hidden comment: Res2)
R39  value 1K  [2012[0805]]  (hidden comment: Res2)
R40  value 1K  [2012[0805]]  (hidden comment: Res2)
R41  value 1K  [2012[0805]]  (hidden comment: Res2)
R42  value 1K  [2012[0805]]  (hidden comment: Res2)
R43  value 1K  [2012[0805]]  (hidden comment: Res2)
R44  value 1K  [2012[0805]]  (hidden comment: Res2)
R45  value 1K  [2012[0805]]  (hidden comment: Res2)
R46  value 1K  [2012[0805]]  (hidden comment: Res2)
R47  value 1K  [2012[0805]]  (hidden comment: Res2)
R48  value 1K  [2012[0805]]  (hidden comment: Res2)
R49  value 1K  [2012[0805]]  (hidden comment: Res2)
R50  value 1K  [2012[0805]]  (hidden comment: Res2)
R51  value 1K  [2012[0805]]  (hidden comment: Res2)
R52  value 1K  [2012[0805]]  (hidden comment: Res2)
R53  value 1K  [2012[0805]]  (hidden comment: Res2)
R54  value 1K  [2012[0805]]  (hidden comment: Res2)
R55  value 1K  [2012[0805]]  (hidden comment: Res2)
R56  value 1K  [2012[0805]]  (hidden comment: Res2)
R57  value 1K  [2012[0805]]  (hidden comment: Res2)
R58  value 1K  [2012[0805]]  (hidden comment: Res2)
R59  value 1K  [2012[0805]]  (hidden comment: Res2)
R60  value 1K  [2012[0805]]  (hidden comment: Res2)
R61  value 1K  [2012[0805]]  (hidden comment: Res2)
R62  value 1K  [2012[0805]]  (hidden comment: Res2)
R63  value 1K  [2012[0805]]  (hidden comment: Res2)
R64  value 1K  [2012[0805]]  (hidden comment: Res2)
R65  value 1K  [2012[0805]]  (hidden comment: Res2)
R66  value 1K  [2012[0805]]  (hidden comment: Res2)
R67  value 1K  [2012[0805]]  (hidden comment: Res2)
R68  value 1K  [2012[0805]]  (hidden comment: Res2)
R69  value 1K  [2012[0805]]  (hidden comment: Res2)
R70  value 1K  [2012[0805]]  (hidden comment: Res2)
R71  value 1K  [2012[0805]]  (hidden comment: Res2)
R72  value 1K  [2012[0805]]  (hidden comment: Res2)
R73  value 1K  [2012[0805]]  (hidden comment: Res2)
R74  value 1K  [2012[0805]]  (hidden comment: Res2)
R75  value 1K  [2012[0805]]  (hidden comment: Res2)
R76  value 1K  [2012[0805]]  (hidden comment: Res2)
R77  value 1K  [2012[0805]]  (hidden comment: Res2)
R78  value 1K  [2012[0805]]  (hidden comment: Res2)
R79  value 1K  [2012[0805]]  (hidden comment: Res2)
R80  value 1K  [2012[0805]]  (hidden comment: Res2)
R81  value 1K  [2012[0805]]  (hidden comment: Res2)
R82  value 1K  [2012[0805]]  (hidden comment: Res2)
R83  value 1K  [2012[0805]]  (hidden comment: Res2)
R84  value 1K  [2012[0805]]  (hidden comment: Res2)
R85  value 1K  [2012[0805]]  (hidden comment: Res2)
R86  value 1K  [2012[0805]]  (hidden comment: Res2)
R87  value 1K  [2012[0805]]  (hidden comment: Res2)
R88  value 1K  [2012[0805]]  (hidden comment: Res2)
R89  value 1K  [2012[0805]]  (hidden comment: Res2)
R90  value 1K  [2012[0805]]  (hidden comment: Res2)
R91  value 1K  [2012[0805]]  (hidden comment: Res2)
R92  value 1K  [2012[0805]]  (hidden comment: Res2)
R93  value 1K  [2012[0805]]  (hidden comment: Res2)
R94  value 1K  [2012[0805]]  (hidden comment: Res2)
R95  value 1K  [2012[0805]]  (hidden comment: Res2)
R96  value 1K  [2012[0805]]  (hidden comment: Res2)
R97  value 1K  [2012[0805]]  (hidden comment: Res2)
R98  value 1K  [2012[0805]]  (hidden comment: Res2)
R99  value 1K  [2012[0805]]  (hidden comment: Res2)
R100  value 1K  [2012[0805]]  (hidden comment: Res2)
R101  value 1K  [2012[0805]]  (hidden comment: Res2)
R102  value 1K  [2012[0805]]  (hidden comment: Res2)
R103  value 1K  [2012[0805]]  (hidden comment: Res2)
R104  value 1K  [2012[0805]]  (hidden comment: Res2)
R105  value 1K  [2012[0805]]  (hidden comment: Res2)
R106  value 1K  [2012[0805]]  (hidden comment: Res2)
R107  value 1K  [2012[0805]]  (hidden comment: Res2)
R108  value 1K  [2012[0805]]  (hidden comment: Res2)
R109  value 1K  [2012[0805]]  (hidden comment: Res2)
R110  value 1K  [2012[0805]]  (hidden comment: Res2)
R111  value 1K  [2012[0805]]  (hidden comment: Res2)
R112  value 1K  [2012[0805]]  (hidden comment: Res2)
R113  value 1K  [2012[0805]]  (hidden comment: Res2)
R114  value 1K  [2012[0805]]  (hidden comment: Res2)
R115  value 1K  [2012[0805]]  (hidden comment: Res2)
R116  value 1K  [2012[0805]]  (hidden comment: Res2)
R117  value 1K  [2012[0805]]  (hidden comment: Res2)
R118  value 1K  [2012[0805]]  (hidden comment: Res2)
R119  value 1K  [2012[0805]]  (hidden comment: Res2)
R120  value 1K  [2012[0805]]  (hidden comment: Res2)
R121  value 1K  [2012[0805]]  (hidden comment: Res2)
R122  value 1K  [2012[0805]]  (hidden comment: Res2)
R123  value 1K  [2012[0805]]  (hidden comment: Res2)
R124  value 1K  [2012[0805]]  (hidden comment: Res2)
R125  value 1K  [2012[0805]]  (hidden comment: Res2)
R126  value 1K  [2012[0805]]  (hidden comment: Res2)
R127  value 1K  [2012[0805]]  (hidden comment: Res2)
R128  value 1K  [2012[0805]]  (hidden comment: Res2)
R129  value 1K  [2012[0805]]  (hidden comment: Res2)
R130  value 1K  [2012[0805]]  (hidden comment: Res2)
R131  value 1K  [2012[0805]]  (hidden comment: Res2)
R132  value 1K  [2012[0805]]  (hidden comment: Res2)
R133  value 1K  [2012[0805]]  (hidden comment: Res2)
R134  value 1K  [2012[0805]]  (hidden comment: Res2)
R135  value 1K  [2012[0805]]  (hidden comment: Res2)
R136  value 1K  [2012[0805]]  (hidden comment: Res2)
R137  value 1K  [2012[0805]]  (hidden comment: Res2)
R138  value 1K  [2012[0805]]  (hidden comment: Res2)
R139  value 1K  [2012[0805]]  (hidden comment: Res2)
R140  value 1K  [2012[0805]]  (hidden comment: Res2)
R141  value 1K  [2012[0805]]  (hidden comment: Res2)
R142  value 1K  [2012[0805]]  (hidden comment: Res2)
R143  value 1K  [2012[0805]]  (hidden comment: Res2)
R144  value 1K  [2012[0805]]  (hidden comment: Res2)
R145  value 1K  [2012[0805]]  (hidden comment: Res2)
R146  value 33.2k  [2012[0805]]  (hidden comment: Res2)
R147  value 1K  [2012[0805]]  (hidden comment: Res2)
R148  value 1K  [2012[0805]]  (hidden comment: Res2)
R149  value 1K  [2012[0805]]  (hidden comment: Res2)
R150  value 1K  [2012[0805]]  (hidden comment: Res2)
R151  value 1K  [2012[0805]]  (hidden comment: Res2)
R152  value 1K  [2012[0805]]  (hidden comment: Res2)
R153  value 1K  [2012[0805]]  (hidden comment: Res2)
R154  value 1K  [2012[0805]]  (hidden comment: Res2)
R155  value 1K  [2012[0805]]  (hidden comment: Res2)
R156  value 1K  [2012[0805]]  (hidden comment: Res2)
R157  value 2211  [2012[0805]]  (hidden comment: Res2)
R158  value 1K  [2012[0805]]  (hidden comment: Res2)
R159  value 1K  [2012[0805]]  (hidden comment: Res2)
R160  value 1K  [2012[0805]]  (hidden comment: Res2)
R161  value 1K  [2012[0805]]  (hidden comment: Res2)
R162  value 1K  [2012[0805]]  (hidden comment: Res2)
R163  value 1K  [2012[0805]]  (hidden comment: Res2)
R164  value 1K  [2012[0805]]  (hidden comment: Res2)
R165  value 1K  [2012[0805]]  (hidden comment: Res2)
R166  value 1K  [2012[0805]]  (hidden comment: Res2)
R167  value 1K  [2012[0805]]  (hidden comment: Res2)
R168  value 1K  [2012[0805]]  (hidden comment: Res2)
R169  value 1K  [2012[0805]]  (hidden comment: Res2)
R170  value 1K  [2012[0805]]  (hidden comment: Res2)
R171  value 1K  [2012[0805]]  (hidden comment: Res2)
R172  value 1K  [2012[0805]]  (hidden comment: Res2)
R173  value 1K  [2012[0805]]  (hidden comment: Res2)
R174  value 1K  [2012[0805]]  (hidden comment: Res2)
R175  value 1K  [2012[0805]]  (hidden comment: Res2)
R176  value 1K  [2012[0805]]  (hidden comment: Res2)
R177  value 1K  [2012[0805]]  (hidden comment: Res2)
R178  value 1K  [2012[0805]]  (hidden comment: Res2)
R179  value 1K  [2012[0805]]  (hidden comment: Res2)
R180  value 1K  [2012[0805]]  (hidden comment: Res2)
R181  value 1K  [2012[0805]]  (hidden comment: Res2)
R182  value 1K  [2012[0805]]  (hidden comment: Res2)
R183  value 1K  [2012[0805]]  (hidden comment: Res2)
R184  value 1K  [2012[0805]]  (hidden comment: Res2)
R185  value 1K  [2012[0805]]  (hidden comment: Res2)
R186  value 1K  [2012[0805]]  (hidden comment: Res2)
R187  value 1K  [2012[0805]]  (hidden comment: Res2)
R188  value 1K  [2012[0805]]  (hidden comment: Res2)
R189  value 1K  [2012[0805]]  (hidden comment: Res2)
R190  value 1K  [2012[0805]]  (hidden comment: Res2)
R191  value 1K  [2012[0805]]  (hidden comment: Res2)
R192  value 1K  [2012[0805]]  (hidden comment: Res2)
R193  value 1K  [2012[0805]]  (hidden comment: Res2)
R194  value 1K  [2012[0805]]  (hidden comment: Res2)
R195  value 1K  [2012[0805]]  (hidden comment: Res2)
R196  value 1K  [2012[0805]]  (hidden comment: Res2)
R197  value 1K  [2012[0805]]  (hidden comment: Res2)
R198  value 1K  [2012[0805]]  (hidden comment: Res2)
R199  value 1K  [2012[0805]]  (hidden comment: Res2)
R200  value 1K  [2012[0805]]  (hidden comment: Res2)
R201  value 1K  [2012[0805]]  (hidden comment: Res2)
R202  value 1K  [2012[0805]]  (hidden comment: Res2)
R203  value 1K  [2012[0805]]  (hidden comment: Res2)
R204  value 1K  [2012[0805]]  (hidden comment: Res2)
R205  value 1K  [2012[0805]]  (hidden comment: Res2)
R206  value 1K  [2012[0805]]  (hidden comment: Res2)
R207  value 1K  [2012[0805]]  (hidden comment: Res2)
R208  value 1K  [2012[0805]]  (hidden comment: Res2)
R209  value 1K  [2012[0805]]  (hidden comment: Res2)
R210  value 1K  [2012[0805]]  (hidden comment: Res2)
R211  value 1K  [2012[0805]]  (hidden comment: Res2)
R212  value 1K  [2012[0805]]  (hidden comment: Res2)
R213  value 1K  [2012[0805]]  (hidden comment: Res2)
R214  value 1K  [2012[0805]]  (hidden comment: Res2)
R215  value 1K  [2012[0805]]  (hidden comment: Res2)
R216  value 1K  [2012[0805]]  (hidden comment: Res2)
R217  value 1K  [2012[0805]]  (hidden comment: Res2)
R218  value 1K  [2012[0805]]  (hidden comment: Res2)
R219  value 1K  [2012[0805]]  (hidden comment: Res2)
R220  value 1K  [2012[0805]]  (hidden comment: Res2)
R221  value 1K  [2012[0805]]  (hidden comment: Res2)
R222  value 1K  [2012[0805]]  (hidden comment: Res2)
R223  value 1K  [2012[0805]]  (hidden comment: Res2)
R224  value 1K  [2012[0805]]  (hidden comment: Res2)
R225  value 1K  [2012[0805]]  (hidden comment: Res2)
R226  value 1K  [2012[0805]]  (hidden comment: Res2)
R227  value 1K  [2012[0805]]  (hidden comment: Res2)
R228  value 1K  [2012[0805]]  (hidden comment: Res2)
R229  value 1K  [2012[0805]]  (hidden comment: Res2)
R230  value 1K  [2012[0805]]  (hidden comment: Res2)
R231  value 1K  [2012[0805]]  (hidden comment: Res2)
R232  value 1K  [2012[0805]]  (hidden comment: Res2)
R233  value 1K  [2012[0805]]  (hidden comment: Res2)
R234  value 1K  [2012[0805]]  (hidden comment: Res2)
R235  value 1K  [2012[0805]]  (hidden comment: Res2)
R236  value 1K  [2012[0805]]  (hidden comment: Res2)
R237  value 1K  [2012[0805]]  (hidden comment: Res2)
R238  value 1K  [2012[0805]]  (hidden comment: Res2)
R239  value 1K  [2012[0805]]  (hidden comment: Res2)
R240  value 1K  [2012[0805]]  (hidden comment: Res2)
R241  value 1K  [2012[0805]]  (hidden comment: Res2)
R242  value 1K  [2012[0805]]  (hidden comment: Res2)
R243  value 1K  [2012[0805]]  (hidden comment: Res2)
R244  value 1K  [2012[0805]]  (hidden comment: Res2)
R245  value 1K  [2012[0805]]  (hidden comment: Res2)
R246  value 1K  [2012[0805]]  (hidden comment: Res2)
R247  value 1K  [2012[0805]]  (hidden comment: Res2)
R248  value 1K  [2012[0805]]  (hidden comment: Res2)
R249  value 1K  [2012[0805]]  (hidden comment: Res2)
R250  value 1K  [2012[0805]]  (hidden comment: Res2)
R251  value 1K  [2012[0805]]  (hidden comment: Res2)
R252  value 1K  [2012[0805]]  (hidden comment: Res2)
R253  value 1K  [2012[0805]]  (hidden comment: Res2)
R254  value 1K  [2012[0805]]  (hidden comment: Res2)
R255  value 1K  [2012[0805]]  (hidden comment: Res2)
R256  value 1K  [2012[0805]]  (hidden comment: Res2)
R257  value 1K  [2012[0805]]  (hidden comment: Res2)
R258  value 1K  [2012[0805]]  (hidden comment: Res2)
R259  value 1K  [2012[0805]]  (hidden comment: Res2)
R260  value 1K  [2012[0805]]  (hidden comment: Res2)
R261  value 1K  [2012[0805]]  (hidden comment: Res2)
R262  value 1K  [2012[0805]]  (hidden comment: Res2)
R263  value 1K  [2012[0805]]  (hidden comment: Res2)
R264  value 1K  [2012[0805]]  (hidden comment: Res2)
R265  value 1K  [2012[0805]]  (hidden comment: Res2)
R266  value 1K  [2012[0805]]  (hidden comment: Res2)
R267  value 1K  [2012[0805]]  (hidden comment: Res2)
R268  value 1K  [2012[0805]]  (hidden comment: Res2)
R269  value 1K  [2012[0805]]  (hidden comment: Res2)
R270  value 1K  [2012[0805]]  (hidden comment: Res2)
R271  value 1K  [2012[0805]]  (hidden comment: Res2)
R272  value 1K  [2012[0805]]  (hidden comment: Res2)
R273  value 1K  [2012[0805]]  (hidden comment: Res2)
R274  value 1K  [2012[0805]]  (hidden comment: Res2)
R275  value 1K  [2012[0805]]  (hidden comment: Res2)
R276  value 1K  [2012[0805]]  (hidden comment: Res2)
R277  value 1K  [2012[0805]]  (hidden comment: Res2)
R278  value 1K  [2012[0805]]  (hidden comment: Res2)
R279  value 1K  [2012[0805]]  (hidden comment: Res2)
R280  value 1K  [2012[0805]]  (hidden comment: Res2)
R281  value 1K  [2012[0805]]  (hidden comment: Res2)
R282  value 1K  [2012[0805]]  (hidden comment: Res2)
R283  value 1K  [2012[0805]]  (hidden comment: Res2)
R284  value 1K  [2012[0805]]  (hidden comment: Res2)
U200  MC14584BG  [SO14_N]  (parts A,B,C,D,E,F of 6)
U201  LM358D  [751-02_N]  (parts A,B of 2)
U202  LM339AD  [751A-02_L]  (parts A,B,C,D of 4)
U203  LM358D  [751-02_N]  (parts A,B of 2)
U204  LM358D  [751-02_N]  (parts A,B of 2)
U205  TAIU-TL431  [SOT-23B]
U206  TL431  [SOT-23B]
U207  LM339AD  [751A-02_L]  (parts A,B,C,D of 4)
U400  MC14001BD  [751A-03_L]  (parts A,B,C,D of 4)
U401  MC14013BD  [751A-03_L]  (parts A,B of 2)
U402  NE555D  [D008_N]
U600  MC34072D  [SO8_N]  (parts A,B of 2)
U601  LM358D  [751-02_N]  (parts A,B of 2)
U602  LM358D  [751-02_N]  (parts A,B of 2)
U603  LM358D  [751-02_N]  (parts A,B of 2)
u604  RESET IC  [SOT-23B]
u605  RESET IC  [SOT-23B]
U800  MC33269DT-5.0  [TO228P970-3_4L]
U801  MC9S12D64CFU  [841B_N]
U803  RESET IC  [SOT-23B]
U900  MC14584BG  [SO14_N]  (parts A,B,C,D,E,F of 6)
XT800  XTAL  [HC49/4H_SMX]

## Nets
GND: C98.1 C118.1 C119.2 C636.2 P601.1 P601.2 U401.7(GND) U900.7(GND)
N: C2.1 C3.2 C5.2 C6.2 C7.1 C8.1 C10.2 C11.1 C12.1 C13.1 C14.1 C15.1 C17.1 C18.1 C19.2 C20.1 C21.2 C23.1 C27.1 C28.2 C29.1 C30.1 C31.2 C32.2 C33.2 C34.1 C35.1 C36.1 C37.1 C38.2 C40.1 C43.1 C46.1 C47.2 C48.2 C49.1 C50.2 C51.1 C53.1 C54.2 C55.1 C56.2 C57.2 C59.2 C60.1 C61.1 C62.2 C63.2 C65.1 C133.1 C230.2 C236.2 DB2.1(A) DB3.1(A) OC402.4(E) P202.1 P202.2 P203.1 P402.5 P402.6 Q9.2(E) q203.2(C) QA3.3(C) QA4.3(C) QA5.3(C) QA6.3(C) QA7.3(C) QA8.3(C) QA14.3(C) R2.1 R16.2 R22.1 R26.1 R27.2 R31.1 R37.1 R38.1 R41.2 R42.2 R73.1 R83.2 R85.2 R90.1 R105.1 R112.2 R114.1 R118.1 R119.2 R122.2 R124.2 R125.2 R128.1 R131.2 R136.1 R137.2 R140.2 R155.1 R156.1 R280.2 U200.7(GND) U201.4(V-) U202.12(GND) U203.4(V-) U204.4(V-) U205.3(VCC) U206.3(VCC) U207.12(GND) U400.7(GND) U402.1(GND)
VCC: C119.1 C636.1 DS2.3(K) P601.3 P601.4 R187.2 U900.14(VCC)
VDD: C12.2 D2.2(K) Q10.3(C) Q209.4(C) R8.1 R20.1 R29.1 R49.2 R50.2 R63.2 R67.1 R68.1 R69.1 R78.1 R79.1 R87.2 R88.1 R89.1 R99.2 R110.2 R111.2 R142.1 R143.2 R144.2 R145.2 R278.1 U401.9(D) U401.14(VDD)
VDD1: C19.1 C21.1 C23.2 Q1.3(C) Q4.3(C) Q5.3(C) Q7.3(C) R49.1 R50.1 U400.14(VDD)
VDD12: C33.1 C133.2 Q6.3(C) Q8.3(C) R67.2 R68.2 U200.14(VCC)
1: C5.1 R15.1 R16.1 R17.2 U203.2(IN-)
15V: C20.2 C230.1 DZ1.3(K) P201.1 P402.3 P402.4 Q3.3(C) Q209.3(E) R23.2 R24.2 R28.1 R32.2 R39.2 U207.3(V+)
380V1: P200.3 R4.2 R126.2
380V2: P200.2 R47.2
G_15VTD: C16.2 DD2.3(K) P201.2 R32.1 U207.13(OUT) U207.14(OUT)
I_FPC: P203.3 R72.2 R94.2
OC402-5: C13.2 OC402.5(C) R34.1 R38.2 R39.1 R40.1 U207.5(IN+)
P203-2: C18.2 P203.2 R43.1 R44.1 U207.11(IN+)
P402-1: DB2.3(K) P402.1
P402-2: DB3.3(K) P402.2
RELAY_KD: P203.4 R71.2
U201-3: C3.1 C9.2 R3.2 R4.1 R12.2 U201.3(IN+)
U201-8: C2.2 R8.2 U201.8(V+)
U202-10: C38.1 DD13.3(K) QA10.3(C) R82.1 U202.10(IN-)
U202-11: C40.2 DD3.2(A) DD7.1(A) R90.2 R95.2 U202.11(IN+)
U203-1: C6.1 R18.1 R91.2 R107.1 U203.1(OUT)
U203-3: C7.2 R13.1 U203.3(IN+)
U203-6: R9.1 R10.2 U203.6(IN-)
U203-8: C10.1 R20.2 U203.8(V+)
U400-2: C29.2 R62.1 U400.2(B) U400.13(B) U401.4(R) U401.6(S) U401.8(S)
U401-1: U400.8(A) U401.1(Q)
U401-2: U400.5(A) U401.2(~{Q}) U401.5(D)
U401-13: R61.1 U400.6(B) U400.9(B) U401.13(Q)
V+1: P201.4 R277.1
V+2: P201.3 R6.2
VCC12: C98.2 R187.1
VCC13: C118.2 DS2.1(A) DS2.2(A) R197.1 R198.1 R199.1 R210.2 U800.1(IN)
VDD13: C48.1 R99.1 U204.8(V+)
VDD14: C37.2 R79.2 R81.2 R102.2 R103.2 R104.2 U202.3(V+)
VDD15: C27.2 C52.1 C54.1 C57.1 Q10.2(E) Q12.3(C) R115.2 R117.1 R120.1 R121.1 R133.1 R134.2 R135.2 R279.2 U402.4(RST) U402.8(VCC)
VREF1: C14.2 QA1.3(C) R46.2 U205.1(~{RESET}) U205.2(GND)
VREF2: C15.2 Q2.1(B) QA2.3(C) R25.2 R35.2 R44.2 R45.2 R74.1 U202.8(IN-) U204.3(IN+) U206.1(~{RESET}) U207.4(IN-)
NetC1_1: C1.1 R1.2 R5.2 U201.6(IN-)
NetC1_2: C1.2 R7.1 U201.7(OUT)
NetC4_1: C4.1 R14.1 U201.1(OUT)
NetC4_2: C4.2 R11.2 U201.2(IN-)
NetC8_2: C8.2 D4.3(K) R15.2
NetC9_1: C9.1 R17.1
NetC11_2: C11.2 R19.2 U203.5(IN+)
NetC16_1: C16.1 R40.2
NetC17_2: C17.2 R41.1 R47.1 U207.8(IN-)
NetC22_2: C22.2 Q5.2(E) QA4.2(E)
NetC24_1: C24.1 Q7.2(E) QA6.2(E)
NetC28_1: C28.1 R116.1 U402.2(TRIG) U402.6(THR)
NetC30_2: C30.2 R61.2 U401.10(R)
NetC31_1: C31.1 R115.1 R118.2 U402.5(CVOLT)
NetC32_1: C32.1 R66.2 R278.2 U200.13(A)
NetC34_2: C34.2 R80.2 R82.2 U202.6(IN-)
NetC35_2: C35.2 R72.1 R77.1
NetC36_2: C36.2 R73.2 U202.4(IN-)
NetC39_1: C39.1 C43.2 R83.1 R84.2 R96.2
NetC39_2: C39.2 R92.2
NetC41_1: C41.1 R84.1 R92.1 R93.2 U204.6(IN-)
NetC41_2: C41.2 C42.2 R93.1
NetC42_1: C42.1 R95.1 U204.7(OUT)
NetC44_1: C44.1 R98.1 R107.2 U204.2(IN-)
NetC44_2: C44.2 R96.1 R98.2 U204.1(OUT)
NetC45_1: C45.1 R80.1 R100.1 R101.2 U202.1(OUT)
NetC45_2: C45.2 QA10.1(B) R103.1
NetC46_2: C46.2 R97.2 U204.5(IN+)
NetC47_1: C47.1 R94.1 R97.1 R106.2
NetC49_2: C49.2 D2.3(K) R110.1
NetC50_1: C50.1 R109.1 R113.1
NetC51_2: C51.2 Q10.1(B) R63.1
NetC52_2: C52.2 QA12.1(B) QA13.1(B) QA13.3(C) R123.1 R127.1 R130.2
NetC53_2: C53.2 QA11.1(B) R117.2 R119.1
NetC55_2: C55.2 Q12.1(B) R128.2 R279.1
NetC56_1: C56.1 Q11.1(B) R125.1 R126.1
NetC58_1: C58.1 R127.2
NetC58_2: C58.2 Q11.3(C) R121.2
NetC59_1: C59.1 DG4.3(K) R129.1 R132.2
NetC60_2: C60.2 Q13.1(B) Q14.1(B) Q14.3(C) R134.1
NetC61_2: C61.2 QA15.3(C)
NetC62_1: C62.1 C64.1 R138.1 R139.2
NetC63_1: C63.1 QA14.1(B) R139.1 R140.1 R141.2
NetC64_2: C64.2 R141.1
NetC65_2: C65.2 QA16.1(B) R144.1 R155.2
NetC66_1: C66.1 QA17.1(B) R145.1
NetC67_1: C67.1 D5.1(A) D6.1(A) R150.2
NetC67_2: C67.2 D5.2(K) D6.2(K) R151.2
NetC68_1: C68.1 R146.1 R150.1
NetC68_2: C68.2 R149.2 R151.1
NetC69_1: C69.1 OC401.2(K) Q16.2(E) R146.2 R147.2
NetC69_2: C69.2 DZ2.3(K) QA19.2(E) R149.1 R153.1
NetC70_1: C70.1 OC401.1(A)
NetC70_2: C70.2 QA19.3(C) R158.1
NetC236_1: C236.1 R1.1 R9.2 R11.1 R13.2
NetD2_1: D2.1(A) R108.1 R109.2
NetD4_1: D4.1(A) R7.2
NetD4_2: D4.2(A) R14.2
NetD5_3: D5.3(K) P204.4
NetD6_3: D6.3(K) P204.1
NetDB2_2: DB2.2(K) DB3.2(K) R137.1 R138.2 R280.1
NetDD2_1: DD2.1(A) R48.2
NetDD2_2: DD2.2(A) R43.2
NetDD3_1: DD3.1(A) R75.2
NetDD3_3: DD3.3(K) R78.2 U202.2(OUT)
NetDD7_2: DD7.2(A) R66.1
NetDD7_3: DD7.3(K) R86.2 R88.2 U202.14(OUT)
NetDD13_1: DD13.1(A) DD13.2(A) QA8.1(B)
NetDZ1_1: DZ1.1(A) QA1.1(B) QA2.1(B) R26.2
NetDZ2_1: DZ2.1(A) Q16.1(B) QA18.3(C) R147.1 R157.2
NetOC400_4: OC400.4(E) Q13.2(E) R131.1
NetOC400_5: OC400.5(C) Q12.2(E)
NetP202_3: P202.3 P202.4 R64.2 R65.2
NetQ1_1: Q1.1(B) QA5.1(B) U400.1(A) U400.4(~{Y})
NetQ1_2: Q1.2(E) QA5.2(E)
NetQ2_2: Q2.2(E) Q3.2(E) R30.1
NetQ2_3: Q2.3(C) Q209.1(B) R28.2
NetQ3_1: Q3.1(B) R29.2 R31.2
NetQ4_1: Q4.1(B) QA3.1(B) U400.10(~{Y}) U400.12(A)
NetQ4_2: Q4.2(E) QA3.2(E)
NetQ5_1: Q5.1(B) QA4.1(B) U400.11(~{Y})
NetQ6_1: Q6.1(B) QA7.1(B) U200.4(Y) U200.6(Y) U200.8(Y) U200.10(Y)
NetQ6_2: Q6.2(E) Q8.1(B) q203.1(B) QA7.2(E)
NetQ7_1: Q7.1(B) QA6.1(B) U400.3(~{Y})
NetQ8_2: Q8.2(E) R64.1
NetQ9_1: Q9.1(B) QA9.3(C) R114.2
NetQ9_3: Q9.3(C) R12.1 R112.1 R113.2 R277.2
NetQ11_2: Q11.2(E) R124.1
NetQ13_3: Q13.3(C) R132.1 R133.2
NetQ14_2: Q14.2(E) R136.2
NetQ15_1: Q15.1(B) QA16.3(C) R156.2
NetQ15_2: Q15.2(E) QA17.3(C)
NetQ15_3: Q15.3(C) QA15.1(B) R143.1
NetQ16_3: Q16.3(C) QA18.1(B) R148.1
Netq203_3: q203.3(E) R65.1
NetQA1_2: QA1.2(E) R23.1
NetQA2_2: QA2.2(E) R24.1
NetQA8_2: QA8.2(E) QA9.2(E) R111.1
NetQA9_1: QA9.1(B) R91.1
NetQA10_2: QA10.2(E) R104.1
NetQA11_2: QA11.2(E) QA12.3(C)
NetQA11_3: QA11.3(C) R116.2 U402.7(DISC)
NetQA12_2: QA12.2(E) R120.2
NetQA13_2: QA13.2(E) R135.1
NetQA14_2: QA14.2(E) QA16.2(E) R142.2
NetQA18_2: QA18.2(E) R148.2 R152.2 R153.2
NetQA19_1: QA19.1(B) R152.1
NetR2_2: R2.2 R3.1 U201.5(IN+)
NetR5_1: R5.1 R10.1 U203.7(OUT)
NetR6_1: R6.1 R21.2 R22.2
NetR18_2: R18.2 R19.1 R21.1
NetR25_1: R25.1 R27.1 U206.2(GND)
NetR30_2: R30.2 R33.2 U207.1(OUT)
NetR33_1: R33.1 R35.1 U207.7(IN+)
NetR34_2: R34.2 R36.2 U207.2(OUT)
NetR36_1: R36.1 R37.2 U207.6(IN-)
NetR42_1: R42.1 R45.1 U207.10(IN-)
NetR46_1: R46.1 R48.1 U207.9(IN+)
NetR58_2: R58.2 R59.1
NetR62_2: R62.2 U200.12(Y)
NetR69_2: R69.2 R70.2
NetR70_1: R70.1 R71.1
NetR74_2: R74.2 R75.1 R76.2
NetR76_1: R76.1 R77.2 U202.5(IN+)
NetR81_1: R81.1 R101.1 R105.2 U202.7(IN+)
NetR85_1: R85.1 R86.1 R87.1 U202.9(IN+)
NetR89_2: R89.2 U200.1(A) U202.13(OUT)
NetR100_2: R100.2 R102.1
NetR106_1: R106.1 R108.2
NetR122_1: R122.1 R123.2
NetR129_2: R129.2 R130.1
NetR157_1: R157.1 R158.2
NetU200_2: U200.2(Y) U200.3(A) U200.5(A) U200.9(A) U200.11(A)
NetU401_3: U401.3(C) U401.11(C) U402.3(OUT)

Not connected (* = marked no-connect by the designer): 1GM 1(B) 2(E) 3(C); C22 1; C24 2; C25 1 2; C26 1 2; C66 2; C71 1 2; C72 1 2; C73 1 2; C74 1 2; C75 1 2; C76 1 2; C77 1 2; C78 1 2; C79 1 2; C80 1 2; C81 1 2; C82 1 2; C83 1 2; C84 1 2; C85 1 2; C86 1 2; C87 1 2; C88 1 2; C89 1 2; C90 1 2; C91 1 2; C92 1 2; C93 1 2; C94 1 2; C95 1 2; C96 1 2; C97 1 2; C99 1 2; C100 1 2; C101 1 2; C102 1 2; C103 1 2; C104 1 2; C105 1 2; C106 1 2; C107 1 2; C108 1 2; C109 1 2; C110 1 2; C111 1 2; C112 1 2; C113 1 2; C114 1 2; C115 1 2; C116 1 2; C117 1 2; C120 1 2; C121 1 2; C122 1 2; C123 1 2; C124 1 2; C125 1 2; C126 1 2; C127 1 2; C128 1 2; C129 1 2; C130 1 2; C131 1 2; C132 1 2; C134 1 2; C135 1 2; C136 1 2; C137 1 2; C138 1 2; C139 1 2; C635 1 2; C820 1 2; C903 1 2; C906 1 2; D3 1(A) 2(A) 3(K); D800 1(A) 2(K); DB1 1(A) 2(K) 3(K); DB4 1(A) 2(K) 3(K); DB5 1(A) 2(K) 3(K); DD1 1(A) 2(A) 3(K); DD4 1(A) 2(A) 3(K); DD5 1(A) 2(A) 3(K); DD6 1(A) 2(A) 3(K); DD8 1(A) 2(A) 3(K); DD9 1(A) 2(A) 3(K); DD10 1(A) 2(A) 3(K); DD11 1(A) 2(A) 3(K); DD12 1(A) 2(A) 3(K); DG1 1(K) 2(K) 3(K); DG2 1(K) 2(K) 3(K); DG3 1(K) 2(K) 3(K); DG4 1(K) 2(K); DG5 1(K) 2(K) 3(K); DG6 1(K) 2(K) 3(K); DS3 1(A) 2(A) 3(K); DS4 1(A) 2(A) 3(K); DZ3 1(A) 3(K); OC400 1(A) 2(K) 3(NC) 6(NC); OC401 3(NC) 4(E) 5(C) 6(NC); OC402 1(A) 2(K) 3(NC) 6(NC); P200 1 4; P204 2 3; P400 1 2 3 4; P401 1 2 3 4; P600 1 2 3 4 5 6; P602 1 2 3 4 5 6; P603 1 2 3 4 5 6; P604 1 2 3 4 5 6 7 8; P900 1 2 3 4 5 6 7 8 9 10; Q17 1(B) 2(E) 3(C); Q400 1(B) 2(C) 3(E); Q401 1(B) 2(C) 3(E); Q900 1(B) 2(C) 3(E); Q908 1(B) 2(C) 3(E); QA15 2(E); QA17 2(E); QA20 1(B) 2(E) 3(C); QA21 1(B) 2(E) 3(C); QA22 1(B) 2(E) 3(C); R51 1 2; R52 1 2; R53 1 2; R54 1 2; R55 1 2; R56 1 2; R57 1 2; R58 1; R59 2; R60 1 2; R154 1 2; R159 1 2; R160 1 2; R161 1 2; R162 1 2; R163 1 2; R164 1 2; R165 1 2; R166 1 2; R167 1 2; R168 1 2; R169 1 2; R170 1 2; R171 1 2; R172 1 2; R173 1 2; R174 1 2; R175 1 2; R176 1 2; R177 1 2; R178 1 2; R179 1 2; R180 1 2; R181 1 2; R182 1 2; R183 1 2; R184 1 2; R185 1 2; R186 1 2; R188 1 2; R189 1 2; R190 1 2; R191 1 2; R192 1 2; R193 1 2; R194 1 2; R195 1 2; R196 1 2; R197 2; R198 2; R199 2; R200 1 2; R201 1 2; R202 1 2; R203 1 2; R204 1 2; R205 1 2; R206 1 2; R207 1 2; R208 1 2; R209 1 2; R210 1; R211 1 2; R212 1 2; R213 1 2; R214 1 2; R215 1 2; R216 1 2; R217 1 2; R218 1 2; R219 1 2; R220 1 2; R221 1 2; R222 1 2; R223 1 2; R224 1 2; R225 1 2; R226 1 2; R227 1 2; R228 1 2; R229 1 2; R230 1 2; R231 1 2; R232 1 2; R233 1 2; R234 1 2; R235 1 2; R236 1 2; R237 1 2; R238 1 2; R239 1 2; R240 1 2; R241 1 2; R242 1 2; R243 1 2; R244 1 2; R245 1 2; R246 1 2; R247 1 2; R248 1 2; R249 1 2; R250 1 2; R251 1 2; R252 1 2; R253 1 2; R254 1 2; R255 1 2; R256 1 2; R257 1 2; R258 1 2; R259 1 2; R260 1 2; R261 1 2; R262 1 2; R263 1 2; R264 1 2; R265 1 2; R266 1 2; R267 1 2; R268 1 2; R269 1 2; R270 1 2; R271 1 2; R272 1 2; R273 1 2; R274 1 2; R275 1 2; R276 1 2; R281 1 2; R282 1 2; R283 1 2; R284 1 2; U401 12(~{Q}); U600 1(OUT) 2(IN-) 3(IN+) 4(V-) 5(IN+) 6(IN-) 7(OUT) 8(V+); U601 1(OUT) 2(IN-) 3(IN+) 4(V-) 5(IN+) 6(IN-) 7(OUT) 8(V+); U602 1(OUT) 2(IN-) 3(IN+) 4(V-) 5(IN+) 6(IN-) 7(OUT) 8(V+); U603 1(OUT) 2(IN-) 3(IN+) 4(V-) 5(IN+) 6(IN-) 7(OUT) 8(V+); u604 1(~{RESET}) 2(GND) 3(VCC); u605 1(~{RESET}) 2(GND) 3(VCC); U800 2(GND) 3(OUT); U801 1(PWM3/KWP3/PP3) 2(PWM2/KWP2/PP2) 3(PWM1/KWP1/PP1) 4(PWM0/KWP0/PP0) 5(IOC0/PT0) 6(IOC1/PT1) 7(IOC2/PT2) 8(IOC3/PT3) 9(VDD1) 10(VSS1) 11(IOC4/PT4) 12(IOC5/PT5) 13(IOC6/PT6) 14(IOC7/PT7) 15(MODC/~{TAGHI}/BKGD) 16(ADDR0/DATA0/PB0) 17(ADDR1/DATA1/PB1) 18(ADDR2/DATA2/PB2) 19(ADDR3/DATA3/PB3) 20(ADDR4/DATA4/PB4) 21(ADDR5/DATA5/PB5) 22(ADDR6/DATA6/PB6) 23(ADDR7/DATA7/PB7) 24(~{XCLKS}/NOACC/PE7) 25(MODB/IPIPE1/PE6) 26(MODA/IPIPE0/PE5) 27(ECLK/PE4) 28(VSSR) 29(VDDR) 30(~{RESET}) 31(VDDPLL) 32(XFC) 33(VSSPLL) 34(EXTAL) 35(XTAL) 36(TEST) 37(~{LSTRB}/~{TAGLO}/PE3) 38(R/~{W}/PE2) 39(~{IRQ}/PE1) 40(~{XIRQ}/PE0) 41(PA0/ADDR8/DATA8) 42(PA1/ADDR9/DATA9) 43(PA2/ADDR10/DATA10) 44(PA3/ADDR11/DATA11) 45(PA4/ADDR12/DATA12) 46(PA5/ADDR13/DATA13) 47(PA6/ADDR14/DATA14) 48(PA7/ADDR15/DATA15) 49(VDD2) 50(VSS2) 51(PAD0/AN0) 52(PAD1/AN1) 53(PAD2/AN2) 54(PAD3/AN3) 55(PAD4/AN4) 56(PAD5/AN5) 57(PAD6/AN6) 58(PAD7/AN7/ETRIG0) 59(VDDA) 60(VRH) 61(VRL) 62(VSSA) 63(PS0/RXD0) 64(PS1/TXD0) 65(PS2/RXD1) 66(PS3/TXD1) 67(VREGEN) 68(PJ7/KWJ7/SCL/TXCAN0) 69(PJ6/KWJ6/SDA/RXCAN0) 70(PM5/TXCAN0/SCK0) 71(PM4/RXCAN0/MOSI) 72(PM3/TXCAN0/~{SS}0) 73(PM2/RXCAN0/MISO0) 74(PM1/TXCAN0/TXB) 75(PM0/RXCAN0/RXB) 76(VSSX) 77(VDDX) 78(PP7/KWP7/PWM7) 79(PP5/KWP5/PWM5) 80(PP4/KWP4/PWM4); U803 1(~{RESET}) 2(GND) 3(VCC); U900 1(A) 2(Y) 3(A) 4(Y) 5(A) 6(Y) 8(Y) 9(A) 10(Y) 11(A) 12(Y) 13(A); XT800 1(OSC1) 2(OSC2)

## Notes on the sheet
- tao xung rang cua
- (near P204) ACIN
- (in symbol MC34172D, part A) A
- (in symbol MC34172D, part B) B

## Library data of the parts
1GM Q1-Q17 = NPN: NPN Bipolar Transistor; Published: 8-Jun-2000; LatestRevisionDate: 17-Jul-2002; LatestRevisionNote: Re-released for DXP Platform.; PackageReference: TO-226; Publisher: Altium Limited; Code_JEDEC: TO-226-AA
C1-C139 = Cap: Capacitor; Published: 8-Jun-2000; LatestRevisionDate: 17-Jul-2002; LatestRevisionNote: Re-released for DXP Platform.; PackageReference: RAD-0.3; Publisher: Altium Limited
C230 C236 C635 C636 C820 C903 C906 = Cap Pol1: Polarized Capacitor (Radial); Published: 8-Jun-2000; LatestRevisionDate: 17-Jul-2002; LatestRevisionNote: Re-released for DXP Platform.; PackageReference: RB7.6-15; Publisher: Altium Limited
D2 D5 D6 = BAV99
D800 DZ1-DZ3 = D Zener: Zener Diode; Published: 8-Jun-2000; LatestRevisionDate: 17-Jul-2002; LatestRevisionNote: Re-released for DXP Platform.; PackageReference: DIODE-0.7; Publisher: Altium Limited
OC400-OC402 = Optoisolator1: 4-Pin Phototransistor Optocoupler; Published: 24-Mar-1999; LatestRevisionDate: 04-Mar-2005; LatestRevisionNote: Sch pins 3 & 4 Swapped.; DatasheetDocument: Nov-2003; PackageReference: DIP-4; Publisher: Altium Limited
P200-P204 P400 P401 P601 = MHDR2X2: Header, 2-Pin, Dual row; LatestRevisionDate: 17-Jul-2002; LatestRevisionNote: Re-released for DXP Platform.; Publisher: Altium Limited
P402 P600 P602 P603 = Header 3X2: Header, 3-Pin, Dual row; LatestRevisionDate: 17-Jul-2002; LatestRevisionNote: Re-released for DXP Platform.; Publisher: Altium Limited
P604 = MHDR2X4: Header, 4-Pin, Dual row; LatestRevisionDate: 17-Jul-2002; LatestRevisionNote: Re-released for DXP Platform.; Publisher: Altium Limited
P900 = Header 5X2H: Header, 5-Pin, Dual row, Right Angle; LatestRevisionDate: 17-Jul-2002; LatestRevisionNote: Re-released for DXP Platform.; Publisher: Altium Limited
q203 Q209 Q400 Q401 Q900 Q908 QA1-QA22 = PNP: PNP Bipolar Transistor; Published: 8-Jun-2000; LatestRevisionDate: 17-Jul-2002; LatestRevisionNote: Re-released for DXP Platform.; PackageReference: SOT-23B; Publisher: Altium Limited; Code_JEDEC: SOT-23
R1-R284 = Res2: Resistor; Published: 8-Jun-2000; LatestRevisionDate: 17-Jul-2002; LatestRevisionNote: Re-released for DXP Platform.; PackageReference: AXIAL-0.4; Publisher: Altium Limited
U200 U900 = 74LVQ14M: Hex Schmitt Inverter; Published: 8-Jun-2000; LatestRevisionDate: 13-Apr-2006; LatestRevisionNote: IPC-7351 Footprint Added.; DatasheetVersion: Feb-1999; PackageVersion: Sep-1998; PackageReference: SO14; Publisher: Altium Limited; PackageDescription: 14-Pin Small Outline Integrated Circuit 1.27 mm Pitch; Code_IPC: SOIC127P600-14; ComponentLink1Description: Manufacturer Link; ComponentLink1URL: http://www.st.com/; ComponentLink2Description: Datasheet; ComponentLink2URL: http://www.st.com/stonline/products/literature/ds/4853/74lvq14.pdf
U201 U203 U204 U601-U603 = LM358D: Dual Low-Power Operational Amplifier; Published: 17-Jul-2002; LatestRevisionDate: 13-Apr-2006; LatestRevisionNote: IPC-7351 Footprint Added.; DatasheetVersion: 1988; PackageReference: 751-02; Publisher: Altium Limited; PackageDescription: 8-Pin Small Outline Integrated Circuit 1.27 mm Pitch; Code_JEDEC: MS-012-AA; Code_IPC: SOIC127P600-8; ComponentLink1Description: Manufacturer Link; ComponentLink1URL: http://www.onsemi.com/site/products/parametrics/0,4446,251,00.html; ComponentLink2Description: Datasheet; ComponentLink2URL: http://www.onsemi.com/pub/Collateral/LM358-D.PDF
U202 U207 = LM339AD: Quad Single-Supply Comparator; Published: 17-Jul-2002; LatestRevisionDate: 13-Apr-2006; LatestRevisionNote: IPC-7351 Footprint Added.; DatasheetVersion: 1988; PackageVersion: 1991; PackageReference: 751A-02; Publisher: Altium Limited; PackageDescription: 14-Pin Small Outline Integrated Circuit 1.27 mm Pitch; Code_IPC: SOIC127P600-14; ComponentLink1Description: Manufacturer Link; ComponentLink1URL: http://www.onsemi.com/site/products/taxonomy/0,4438,133,00.html
U205 U206 u604 u605 U800 U803 = µA78L12CLP: Positive-Voltage Regulator; ComponentAvailability: Obsolete; Published: 15-Apr-2002; LatestRevisionDate: 06-Jun-2005; LatestRevisionNote: Sch pins 1 & 3 swapped; DatasheetVersion: Jul-2000; PackageVersion: Nov-2001; PackageReference: LP03; Publisher: Altium Limited; PackageDescription: TO, Flat Index; 3 In-Line, Axial Leads; Body Dia. 4.8mm; Leads 0.56 x 0.41 mm (max); Code_JEDEC: TO-226-AA; ComponentLink1Description: Manufacturer Link; ComponentLink1URL: http://www.ti.com/; ComponentLink2Description: Datasheet; ComponentLink2URL: http://www-s.ti.com/sc/ds/ua78l12a.pdf
U400 = MC14001BD: Quad 2-Input NOR Gate; Published: 15-Apr-2002; LatestRevisionDate: 13-Apr-2006; LatestRevisionNote: IPC-7351 Footprint Added.; DatasheetVersion: 1995; PackageReference: 751A-03; Publisher: Altium Limited; PackageDescription: 14-Pin Small Outline Integrated Circuit 1.27 mm Pitch; Code_JEDEC: MS-012-AB; Code_IPC: SOIC127P600-14; ComponentLink1Description: Manufacturer Link; ComponentLink1URL: http://www.onsemi.com/; ComponentLink2Description: Datasheet; ComponentLink2URL: http://www.onsemi.com/pub/Collateral/MC14001B-D.PDF
U401 = MC14013BD: Dual D-Type Flip-Flop; Published: 15-Apr-2002; LatestRevisionDate: 13-Apr-2006; LatestRevisionNote: IPC-7351 Footprint Added.; DatasheetVersion: 1995; PackageReference: 751A-03; Publisher: Altium Limited; PackageDescription: 14-Pin Small Outline Integrated Circuit 1.27 mm Pitch; Code_JEDEC: MS-012-AB; Code_IPC: SOIC127P600-14; ComponentLink1Description: Manufacturer Link; ComponentLink1URL: http://www.onsemi.com/; ComponentLink2Description: Datasheet; ComponentLink2URL: http://www.onsemi.com/pub/Collateral/MC14013B-D.PDF
U402 = NE555D: Precision Timer; Published: 16-Jan-2001; LatestRevisionDate: 13-Apr-2006; LatestRevisionNote: IPC-7351 Footprint Added.; DatasheetVersion: Feb-1992; PackageVersion: Jan-1998; PackageReference: D008; Publisher: Altium Limited; PackageDescription: 8-Pin Small Outline Integrated Circuit 1.27 mm Pitch; Code_IPC: SOIC127P600-8; ComponentLink1Description: Manufacturer Link; ComponentLink1URL: http://www.ti.com/; ComponentLink2Description: Datasheet; ComponentLink2URL: http://www-s.ti.com/sc/ds/ne555.pdf
U600 = MC34172D: Low-Power Dual Bipolar Operational Amplifier; Published: 24-Aug-2001; LatestRevisionDate: 13-Apr-2006; LatestRevisionNote: IPC-7351 Footprint Added.; DatasheetVersion: Jun-1991; PackageVersion: Dec-2002; PackageReference: SO8; Publisher: Altium Limited; PackageDescription: 8-Pin Small Outline Integrated Circuit 1.27 mm Pitch; Code_JEDEC: MS-012-AA; Code_IPC: SOIC127P600-8; ComponentLink1Description: Manufacturer Link; ComponentLink1URL: http://www.st.com/
U801 = MC9S12D64CFU: 16-Bit Microcontroller; Published: 21-Mar-2003; LatestRevisionDate: 13-Apr-2006; LatestRevisionNote: IPC-7351 Footprint Added.; DatasheetVersion: 10-Oct-2002; PackageVersion: 2000; PackageReference: 841B; Publisher: Altium Limited; PackageDescription: 80-Pin Plastic Quad Flat Pack 0.65 mm Pitch; Code_IPC: QFP65P1720X1720-80; ComponentLink1Description: Manufacturer Link; ComponentLink1URL: http://www.freescale.com/; ComponentLink2Description: Datasheet; ComponentLink2URL: http://www.freescale.com/files/microcontrollers/doc/data_sheet/9S12DJ64DGV1.pdf
XT800 = XTAL: Crystal Oscillator; Published: 8-Jun-2000; LatestRevisionDate: 17-Jul-2002; LatestRevisionNote: Re-released for DXP Platform.; PackageReference: R38; Publisher: Altium Limited